# EasyEDA Pro project Project.eprj, schematic BachelorV5

## Sheets
1 Power: Board Name: BachelorV5; Create Date: 2026-01-30; Page Name: Power; Project Name: Bachelor; Schematic Name: BachelorV5; Update Date: 2026-04-13; Add into BOM: yes; Company: My Company; Convert to PCB: yes; Date: 2026-01-17; Draw By: IslandRock1; REV: 2.0; Sheet: 1/; spicePre: .
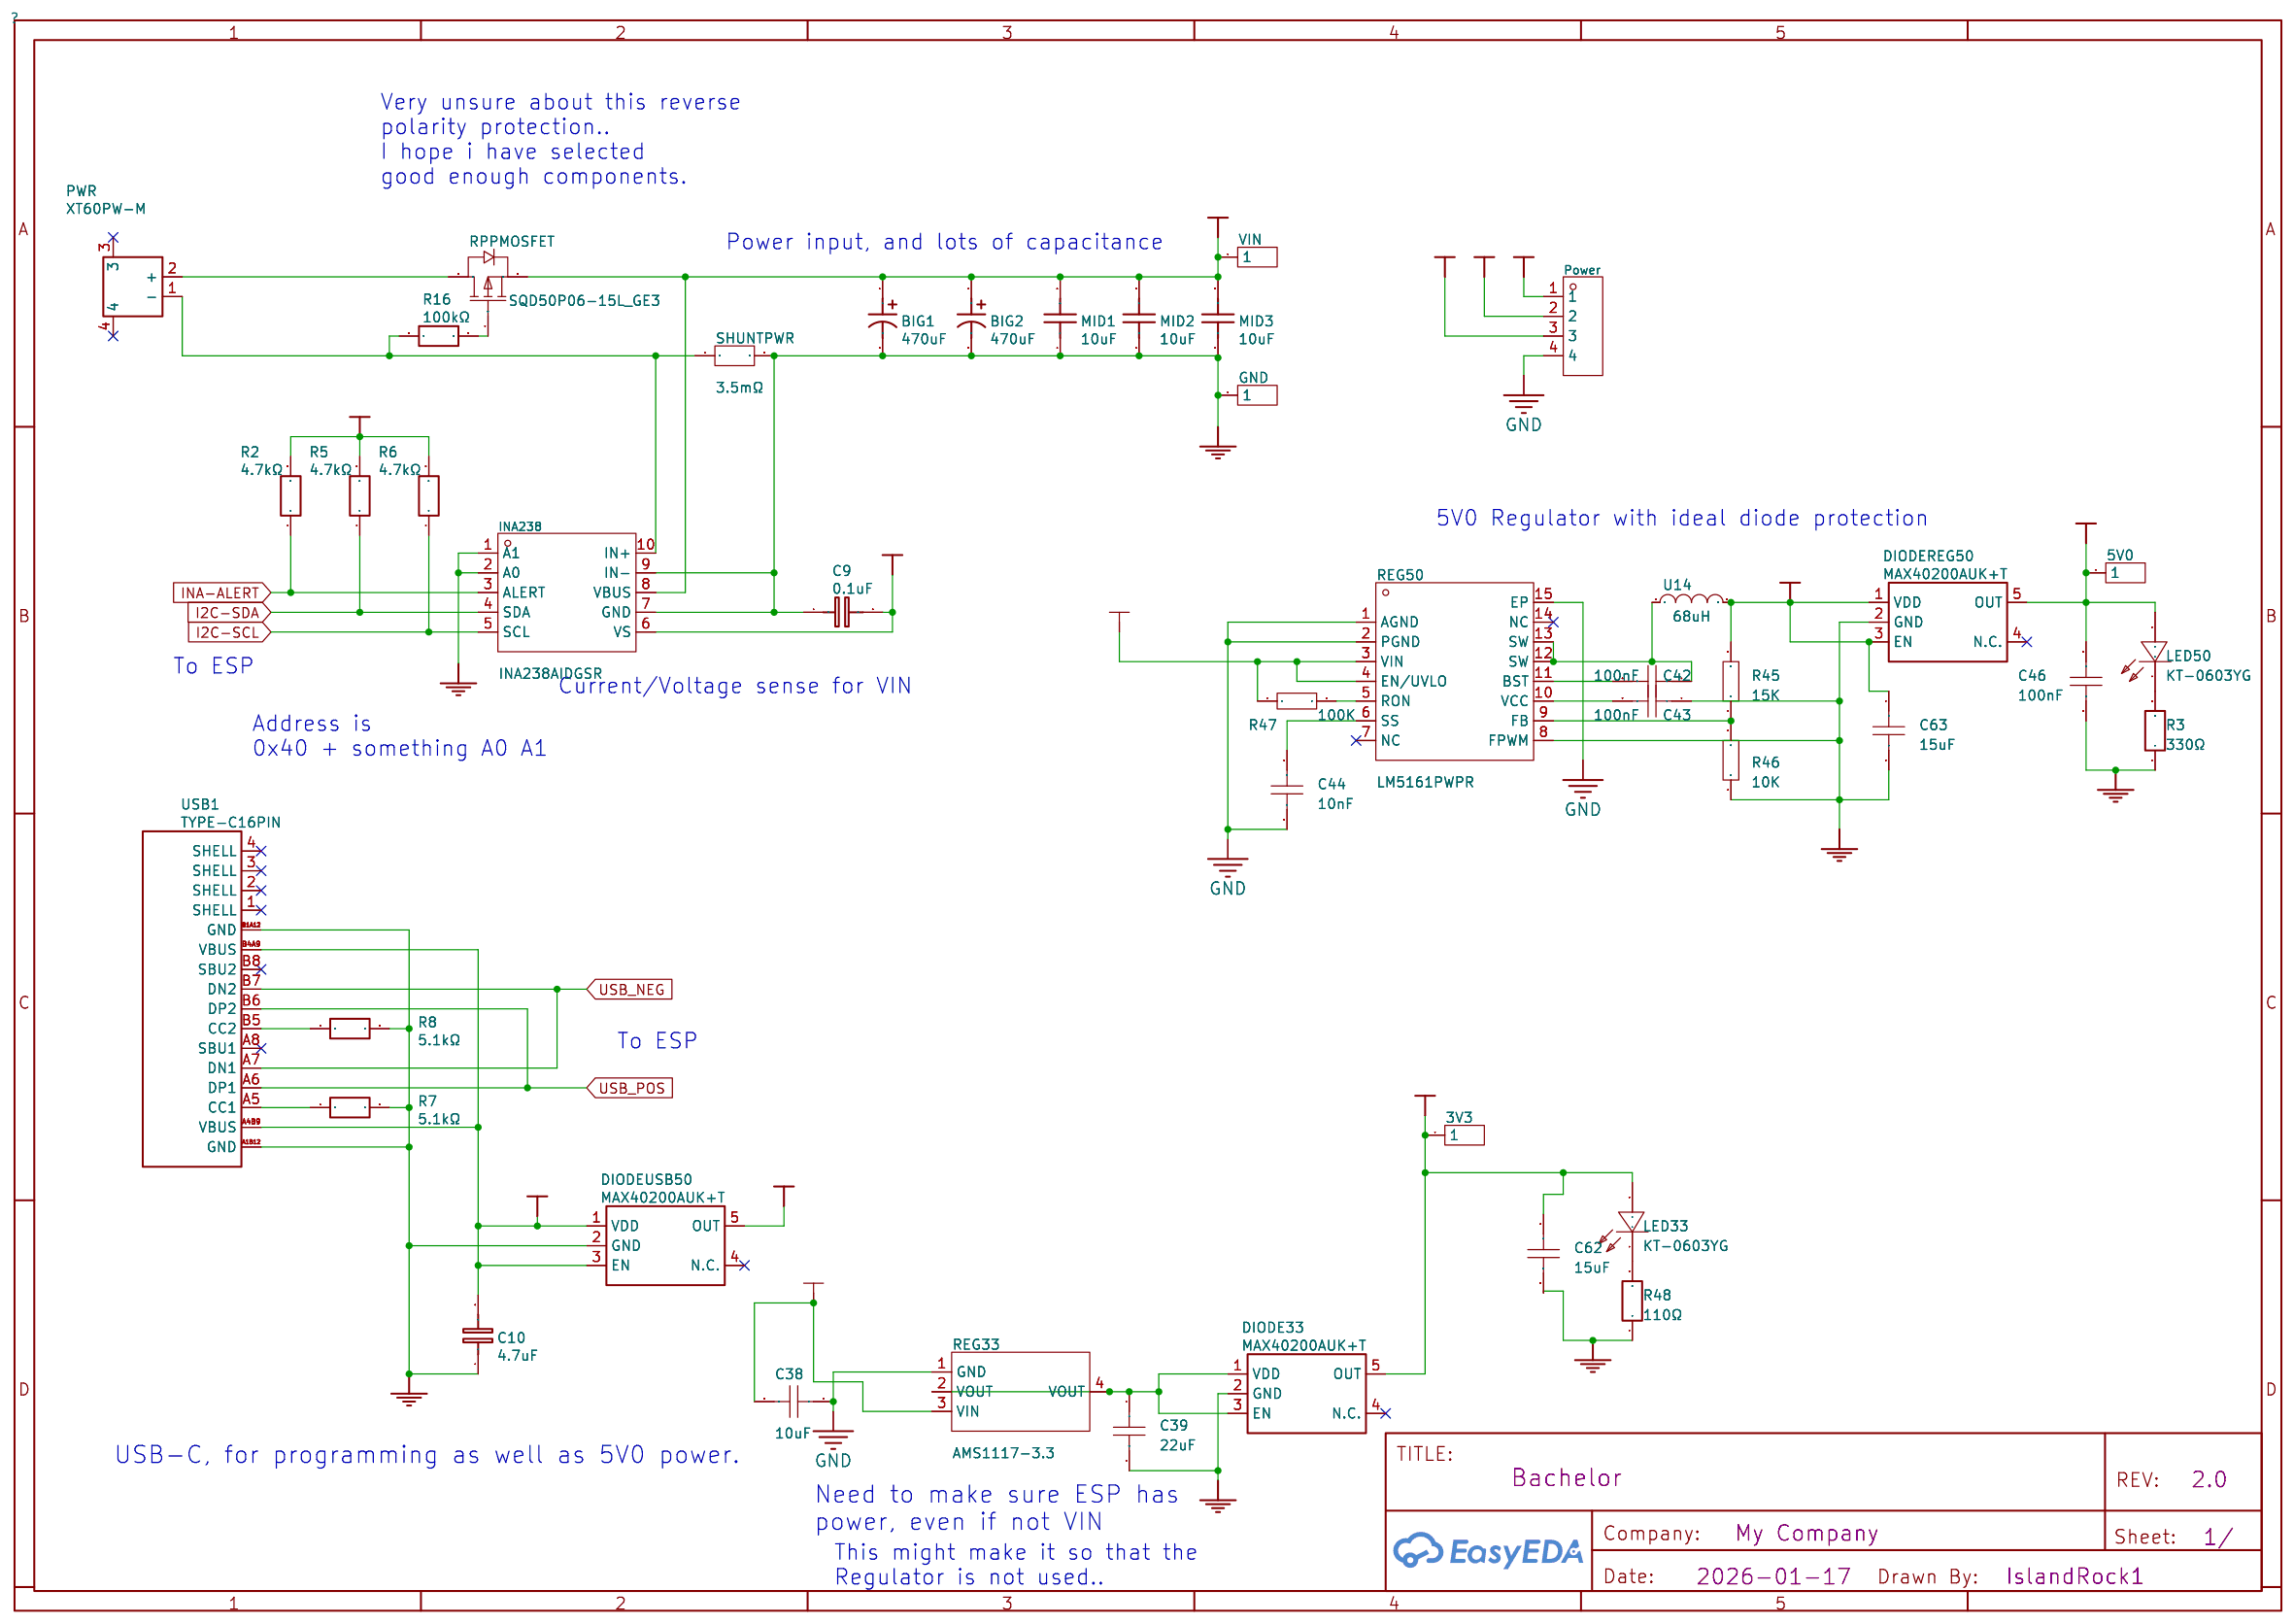
[diagram p0: Power]
2 Motor: Page Name: Motor; Update Date: 2026-04-19; Sheet: 2/
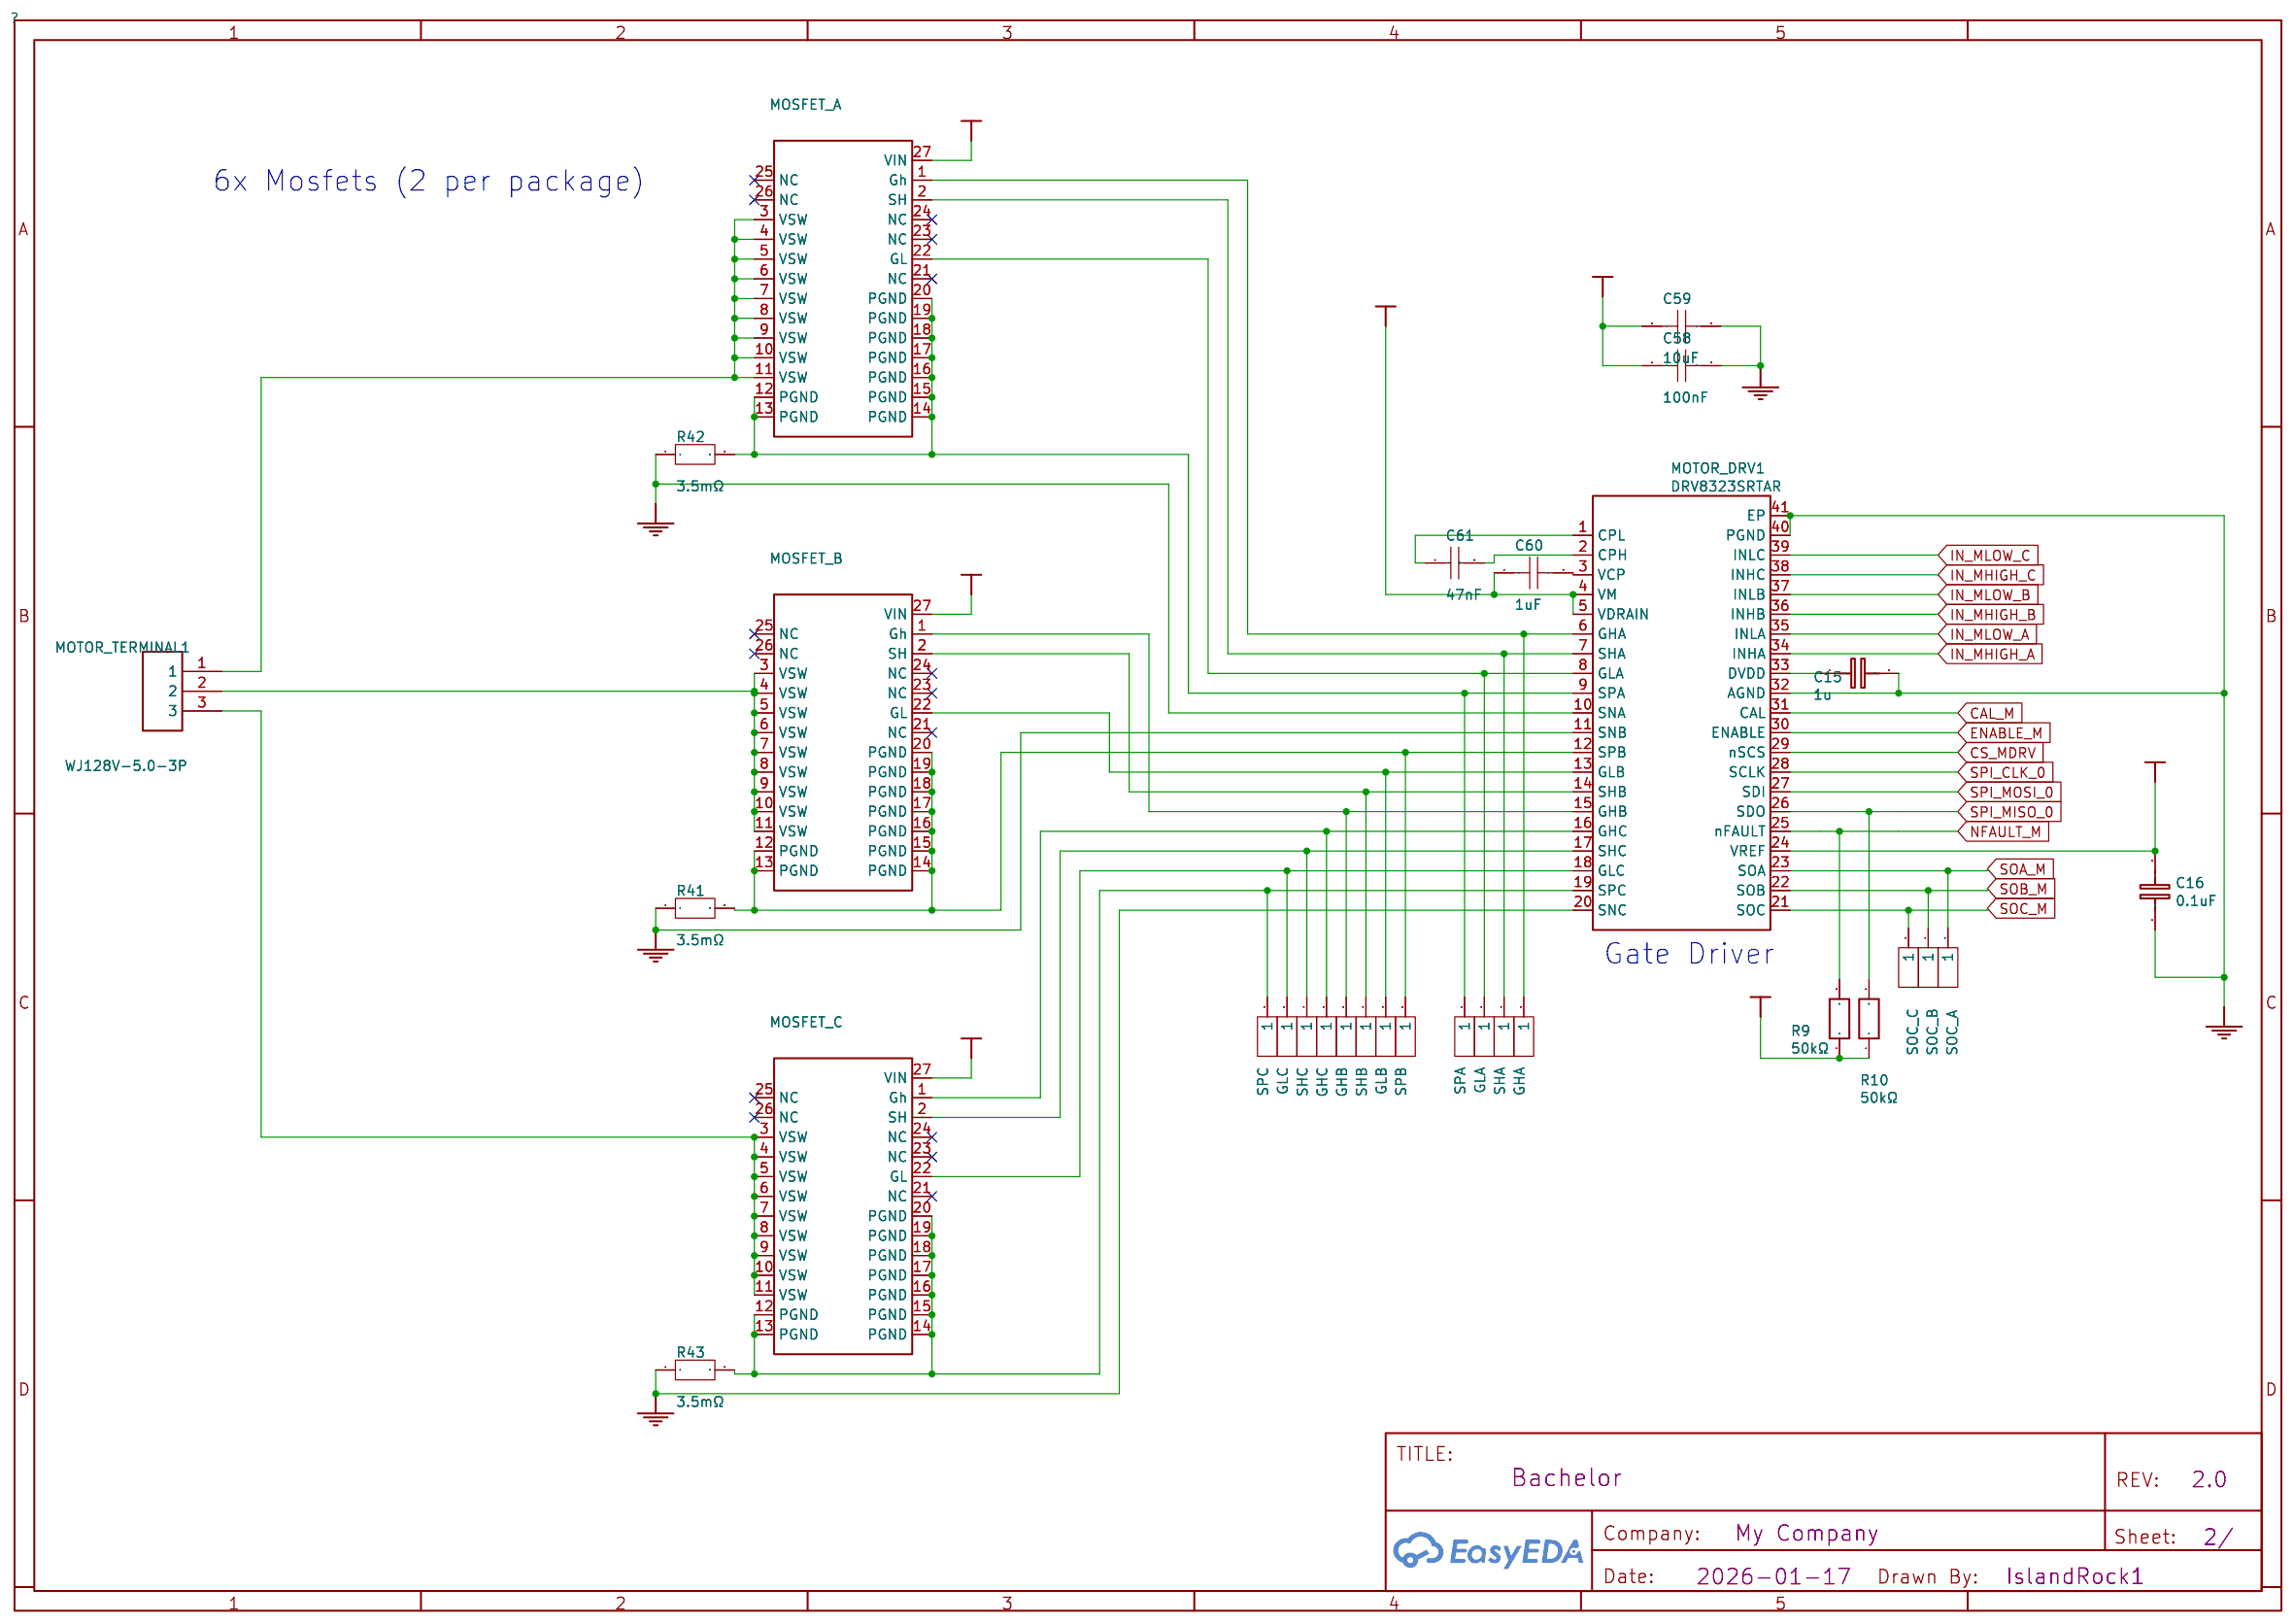
[diagram p1: Motor]
3 ESP32: Page Name: ESP32; Update Date: 2026-04-19; Sheet: 3/
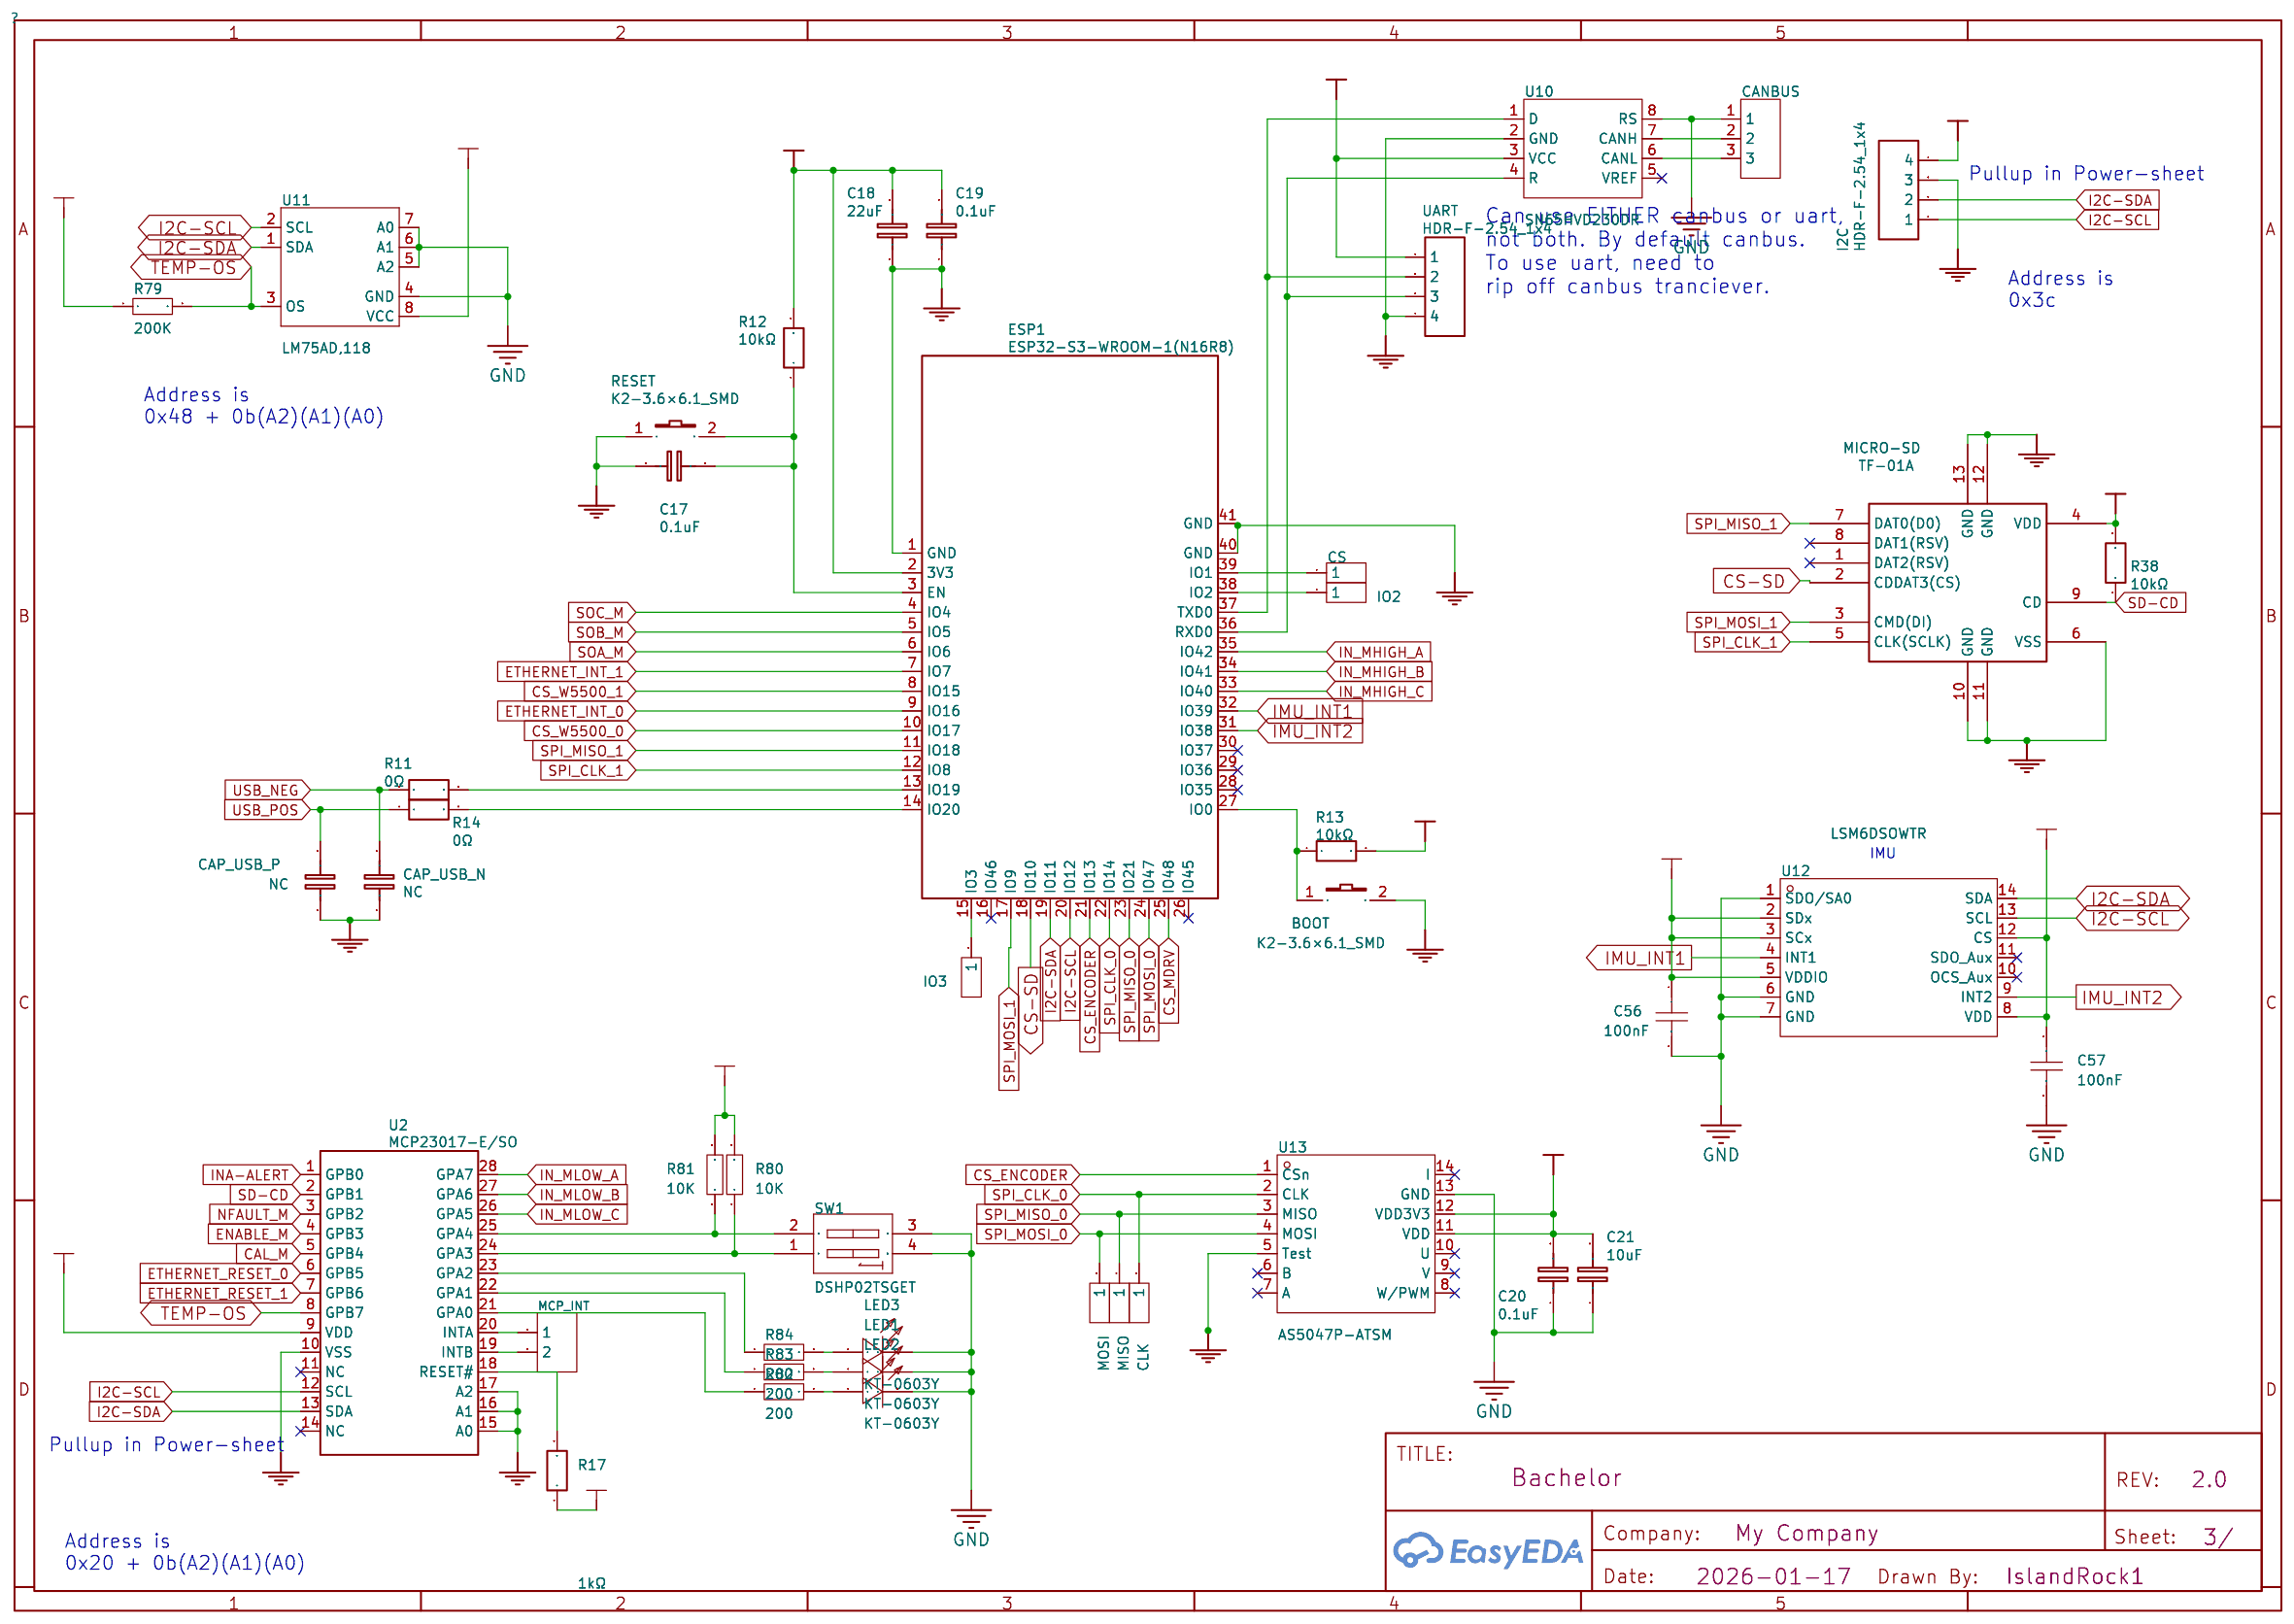
[diagram p2: ESP32]
4 Ethernet_0: Page Name: Ethernet_0; Date: 2026-01-22; REV: 1.0; Sheet: 1/1
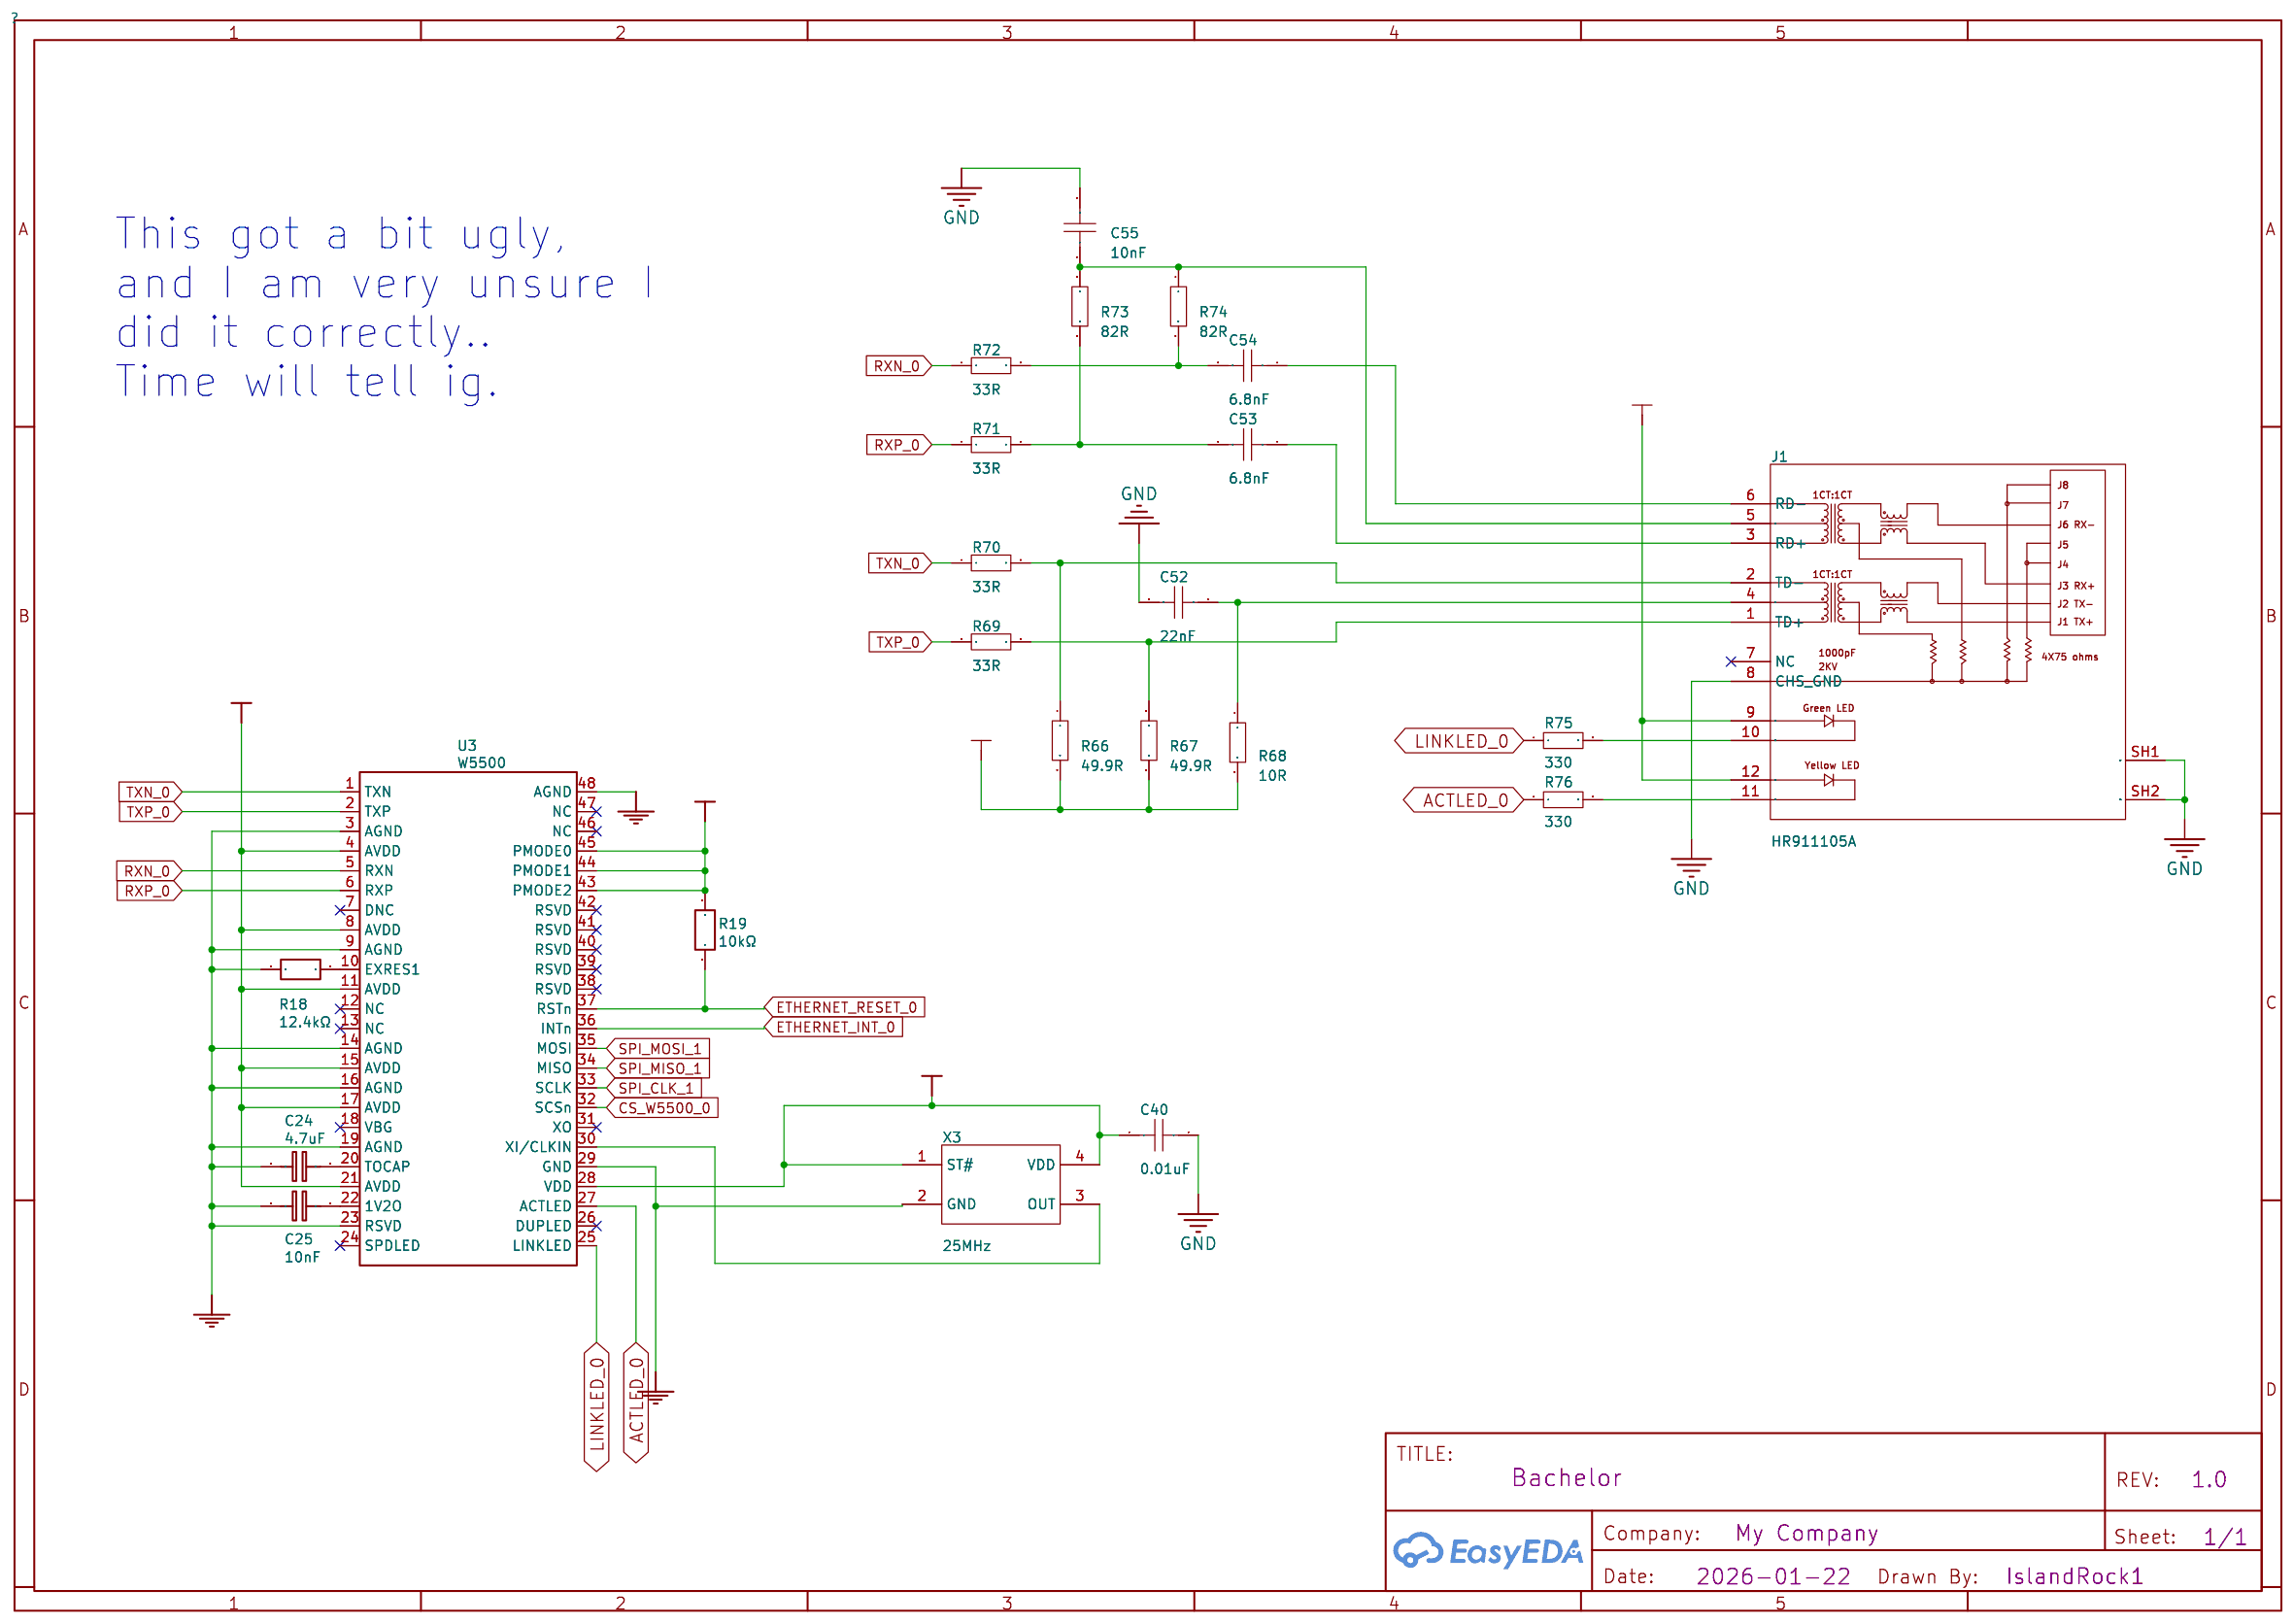
[diagram p3: Ethernet_0]
5 Ethernet_1: Page Name: Ethernet_1; Date: 2026-01-24; REV: 1.0; Sheet: 1/1
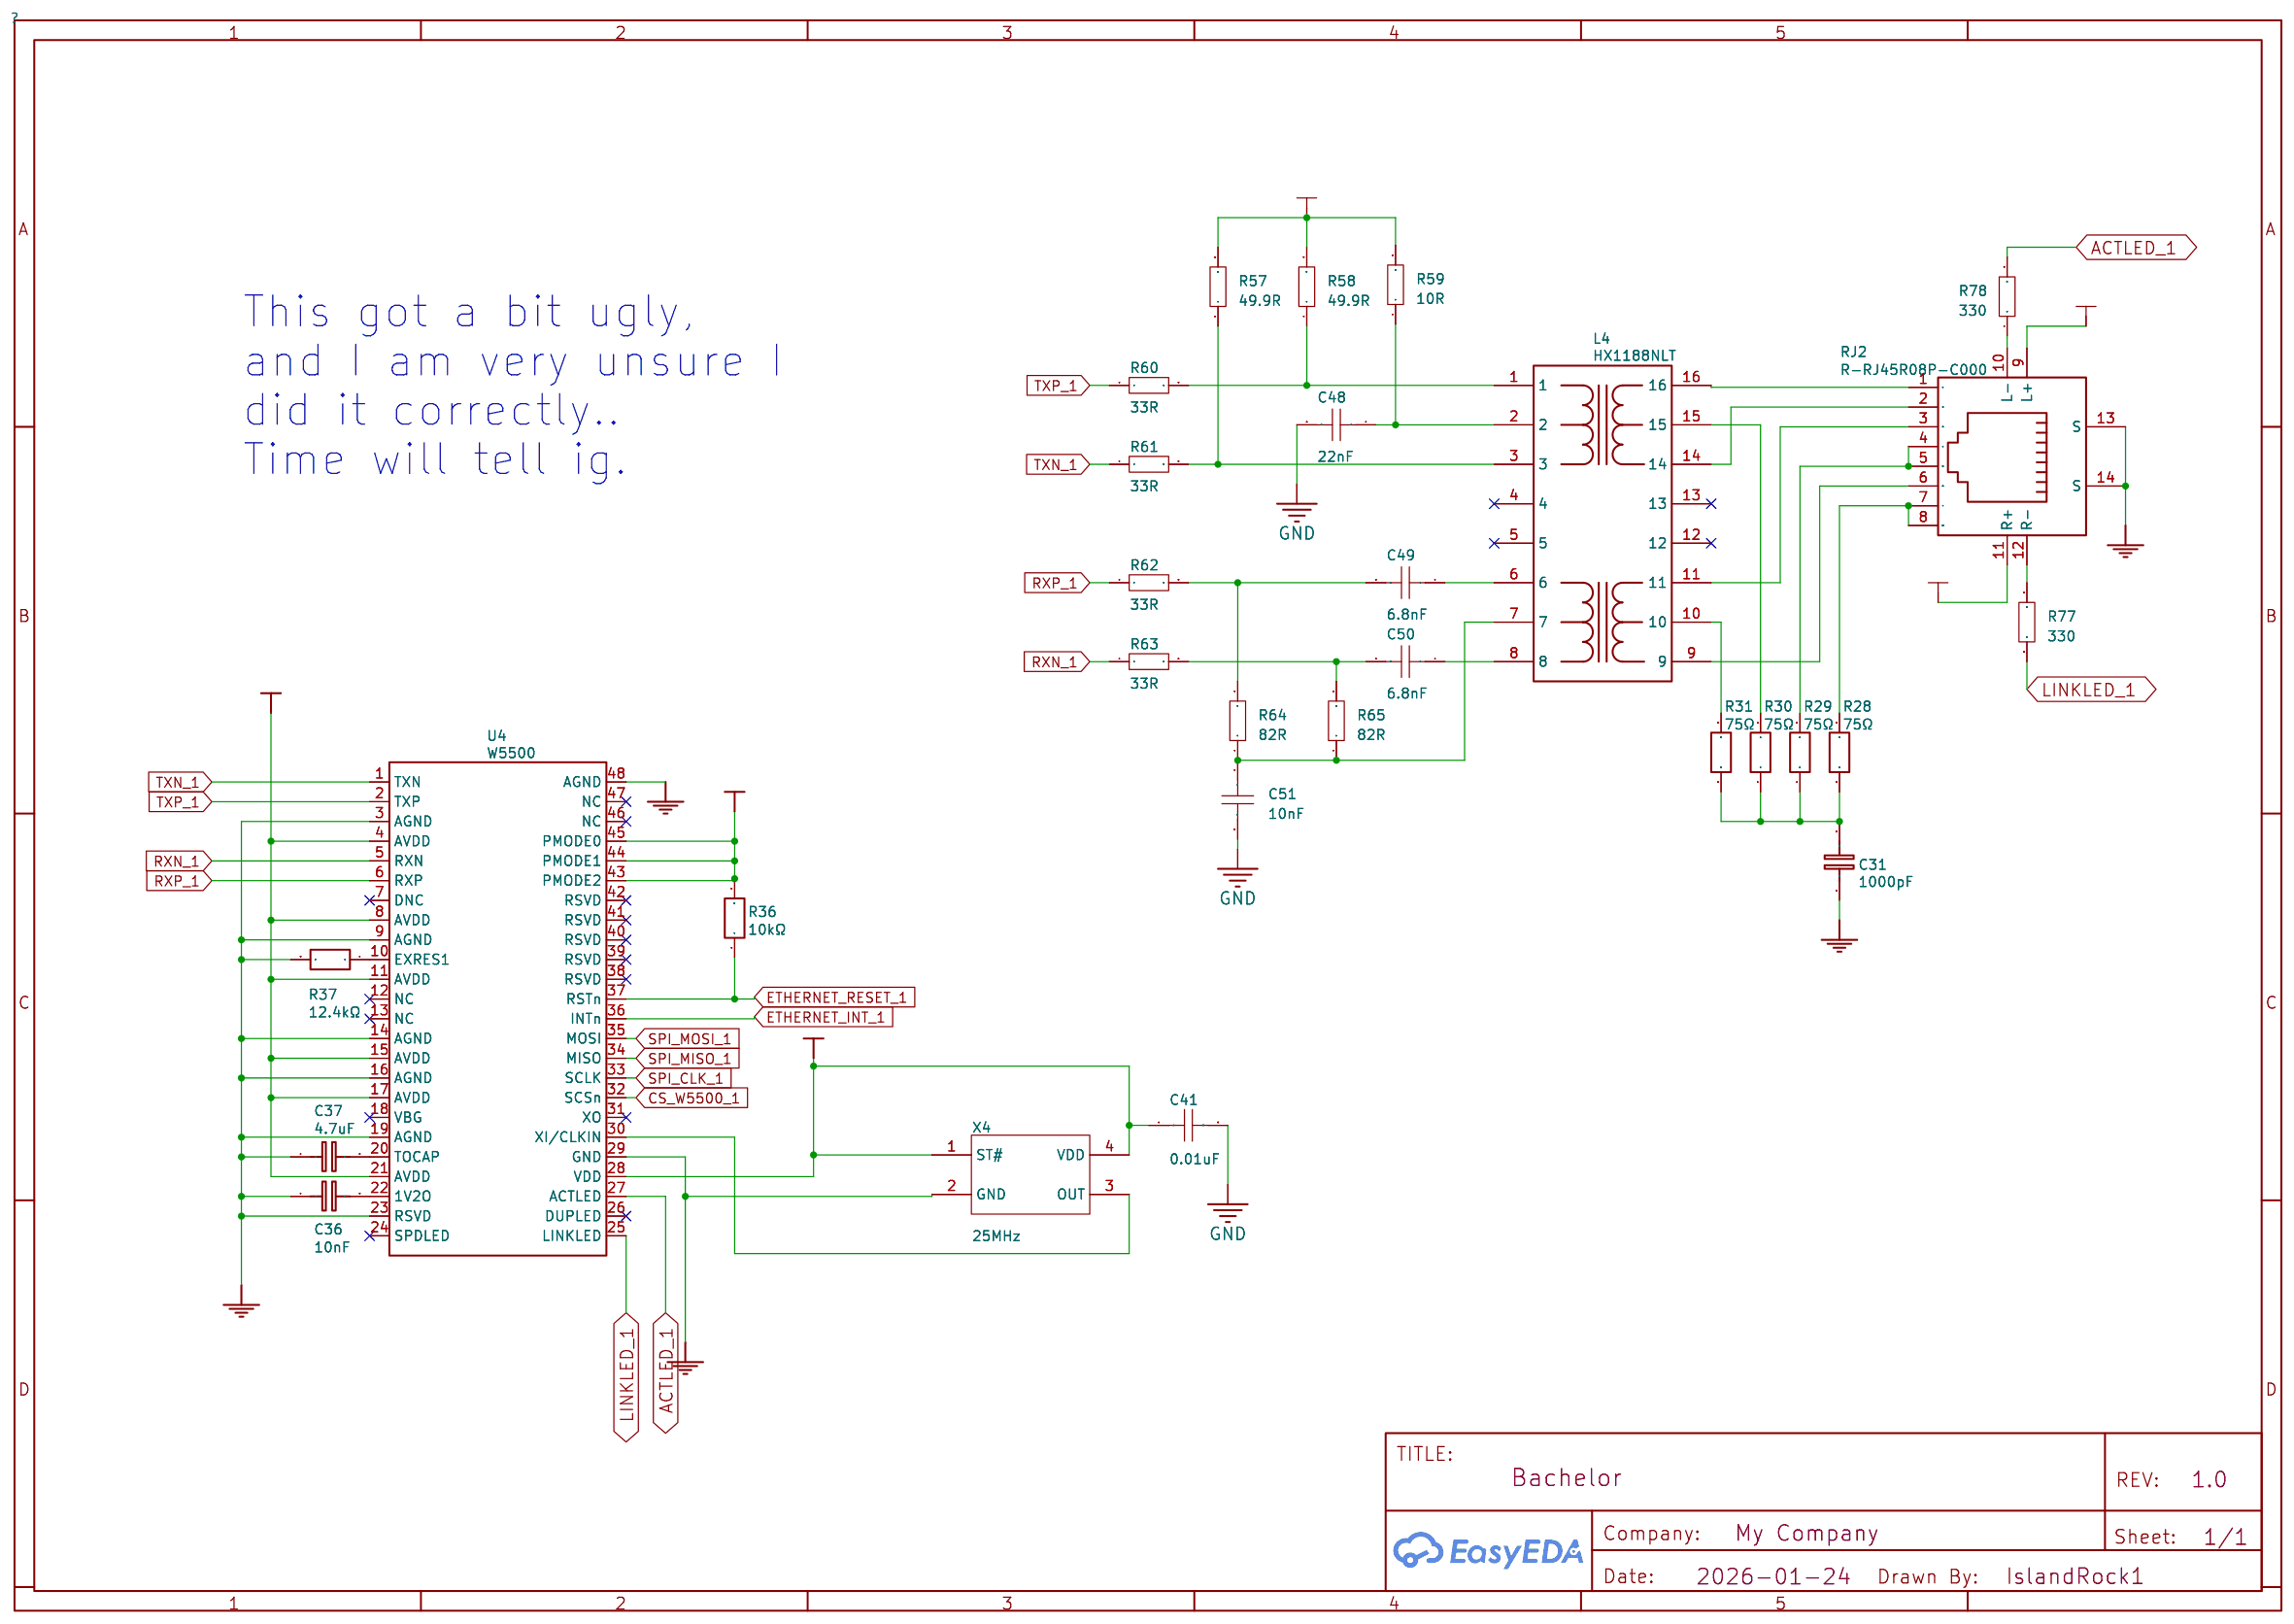
[diagram p4: Ethernet_1]

## Parts
sheet ESP32
BOOT  K2-3.6×6.1_SMD  [KEY-SMD_2P-L6.2-W3.6-LS8.0]
C17  0.1uF  [C0402]
C18  22uF  [C1206]
C19  0.1uF  [C0402]
C20  0.1uF  [C0402]
C21  10uF  [C0805]
C56  100nF  [C0201]
C57  100nF  [C0201]
CANBUS  -  [HDR-TH_3P-P2.54-V-F]
CAP_USB_N  NC  [C0201]
CAP_USB_P  NC  [C0201]
CLK  -  [HDR-TH_1P-V-M_XKB_X4611WV-01I-C28D40]
CS  -  [HDR-TH_1P-V-M_XKB_X4611WV-01I-C28D40]
ESP1  ESP32-S3-WROOM-1(N16R8)  [WIRELM-SMD_ESP32-S3-WROOM-1]
I2C  HDR-F-2.54_1x4  [HDR-F-2.54_1X4]
IO2  -  [HDR-TH_1P-V-M_XKB_X4611WV-01I-C28D40]
IO3  -  [HDR-TH_1P-V-M_XKB_X4611WV-01I-C28D40]
LED1  KT-0603Y  [LED0603-R-RD]
LED2  KT-0603Y  [LED0603-R-RD]
LED3  KT-0603Y  [LED0603-R-RD]
MCP_INT  -  [HDR-TH_2P-P2.54-V-F]
MICRO-SD  TF-01A  [TF-SMD_TF-01A]
MISO  -  [HDR-TH_1P-V-M_XKB_X4611WV-01I-C28D40]
MOSI  -  [HDR-TH_1P-V-M_XKB_X4611WV-01I-C28D40]
R11  0Ω  [R0201]
R12  10kΩ  [R0201]
R13  10kΩ  [R0201]
R14  0Ω  [R0201]
R17  1kΩ  [R0201]
R38  10kΩ  [R0201]
R79  200K  [R0201]
R80  10K  [R0201]
R81  10K  [R0201]
R82  200  [R0201]
R83  200  [R0201]
R84  200  [R0201]
RESET  K2-3.6×6.1_SMD  [KEY-SMD_2P-L6.2-W3.6-LS8.0]
SW1  DSHP02TSGET  [SW-SMD_4P_DSHP02TSGET]
U2  MCP23017-E/SO  [SOIC-28_L18.0-W7.5-P1.27-LS10.3-BL]
U10  SN65HVD230DR  [SOIC-8_L4.9-W3.9-P1.27-LS6.0-BL]
U11  LM75AD,118  [SOIC-8_L5.0-W4.0-P1.27-LS6.0-BL]
U12  LSM6DSOWTR  [LGA-14L_L3.0-W2.5-P0.50-TL]
U13  AS5047P-ATSM  [TSSOP-14_L5.0-W4.4-P0.65-LS6.4-BL]
UART  HDR-F-2.54_1x4  [HDR-F-2.54_1X4]
sheet Ethernet_0
C24  4.7uF  [C0805]
C25  10nF  [C0402]
C40  0.01uF  [C0402]
C52  22nF  [C0201]
C53  6.8nF  [C0201]
C54  6.8nF  [C0201]
C55  10nF  [C0201]
J1  HR911105A  [RJ45-TH_HR911105A]
R18  12.4kΩ  [R0201]
R19  10kΩ  [R0201]
R66  49.9R  [R0201]
R67  49.9R  [R0201]
R68  10R  [R0201]
R69  33R  [R0201]
R70  33R  [R0201]
R71  33R  [R0201]
R72  33R  [R0201]
R73  82R  [R0201]
R74  82R  [R0201]
R75  330  [R0201]
R76  330  [R0201]
U3  W5500  [LQFP-48_L7.0-W7.0-P0.50-LS9.0-BL]
X3  25MHz  [OSC-SMD_4P-L2.5-W2.0-BL]
sheet Ethernet_1
C31  1000pF  [C0402]
C36  10nF  [C0402]
C37  4.7uF  [C0805]
C41  0.01uF  [C0402]
C48  22nF  [C0201]
C49  6.8nF  [C0201]
C50  6.8nF  [C0201]
C51  10nF  [C0201]
L4  HX1188NLT  [RJ45-SMD_HX1188NLT]
R28  75Ω  [R0201]
R29  75Ω  [R0201]
R30  75Ω  [R0201]
R31  75Ω  [R0201]
R36  10kΩ  [R0201]
R37  12.4kΩ  [R0201]
R57  49.9R  [R0201]
R58  49.9R  [R0201]
R59  10R  [R0201]
R60  33R  [R0201]
R61  33R  [R0201]
R62  33R  [R0201]
R63  33R  [R0201]
R64  82R  [R0201]
R65  82R  [R0201]
R77  330  [R0201]
R78  330  [R0201]
RJ2  R-RJ45R08P-C000  [RJ45-TH_R-RJ45R08P-C000]
U4  W5500  [LQFP-48_L7.0-W7.0-P0.50-LS9.0-BL]
X4  25MHz  [OSC-SMD_4P-L2.5-W2.0-BL]
sheet Motor
C15  1u  [C0805]
C16  0.1uF  [C0402]
C58  100nF  [C0402]
C59  10uF  [C1210]
C60  1uF  [C0603]
C61  47nF  [C0603]
GHA  -  [HDR-TH_1P-V-M_XKB_X4611WV-01I-C28D40]
GHB  -  [HDR-TH_1P-V-M_XKB_X4611WV-01I-C28D40]
GHC  -  [HDR-TH_1P-V-M_XKB_X4611WV-01I-C28D40]
GLA  -  [HDR-TH_1P-V-M_XKB_X4611WV-01I-C28D40]
GLB  -  [HDR-TH_1P-V-M_XKB_X4611WV-01I-C28D40]
GLC  -  [HDR-TH_1P-V-M_XKB_X4611WV-01I-C28D40]
MOSFET_A  CSD88599Q5DC  [SON-22_L5.0-W6.0-P0.50-CSD88599Q5DCT]
MOSFET_B  CSD88599Q5DC  [SON-22_L5.0-W6.0-P0.50-CSD88599Q5DCT]
MOSFET_C  CSD88599Q5DC  [SON-22_L5.0-W6.0-P0.50-CSD88599Q5DCT]
MOTOR_DRV1  DRV8323SRTAR  [WQFN-40_L6.0-W6.0-P0.50-TL-EP4.5]
MOTOR_TERMINAL1  WJ128V-5.0-3P  [CONN-TH_3P-P5.00_WJ128V-5.0-3P]
R9  50kΩ  [R0402]
R10  50kΩ  [R0402]
R41  3.5mΩ  [RES-SMD_L6.4-W3.2-R2512]
R42  3.5mΩ  [RES-SMD_L6.4-W3.2-R2512]
R43  3.5mΩ  [RES-SMD_L6.4-W3.2-R2512]
SHA  -  [HDR-TH_1P-V-M_XKB_X4611WV-01I-C28D40]
SHB  -  [HDR-TH_1P-V-M_XKB_X4611WV-01I-C28D40]
SHC  -  [HDR-TH_1P-V-M_XKB_X4611WV-01I-C28D40]
SOC_A  -  [HDR-TH_1P-V-M_XKB_X4611WV-01I-C28D40]
SOC_B  -  [HDR-TH_1P-V-M_XKB_X4611WV-01I-C28D40]
SOC_C  -  [HDR-TH_1P-V-M_XKB_X4611WV-01I-C28D40]
SPA  -  [HDR-TH_1P-V-M_XKB_X4611WV-01I-C28D40]
SPB  -  [HDR-TH_1P-V-M_XKB_X4611WV-01I-C28D40]
SPC  -  [HDR-TH_1P-V-M_XKB_X4611WV-01I-C28D40]
sheet Power
3V3  -  [HDR-TH_1P-V-M_XKB_X4611WV-01I-C28D40]
5V0  -  [HDR-TH_1P-V-M_XKB_X4611WV-01I-C28D40]
BIG1  470uF  [CAP-TH_BD10.0-P5.00-D0.6-FD_2]
BIG2  470uF  [CAP-TH_BD10.0-P5.00-D0.6-FD_2]
C9  0.1uF  [C0402]
C10  4.7uF  [C0805]
C38  10uF  [C0805]
C39  22uF  [C1206]
C42  100nF  [C0201]
C43  100nF  [C0201]
C44  10nF  [C0201]
C46  100nF  [C0201]
C62  15uF  [C0402]
C63  15uF  [C0402]
DIODE33  MAX40200AUK+T  [TSOT-23-5_L2.9-W1.6-P0.95-LS2.8-BL]
DIODEREG50  MAX40200AUK+T  [TSOT-23-5_L2.9-W1.6-P0.95-LS2.8-BL]
DIODEUSB50  MAX40200AUK+T  [TSOT-23-5_L2.9-W1.6-P0.95-LS2.8-BL]
GND  -  [HDR-TH_1P-V-M_XKB_X4611WV-01I-C28D40]
INA238  INA238AIDGSR  [VSSOP-10_L3.0-W3.0-P0.50-LS4.9-BL]
LED33  KT-0603YG  [LED0603-RD]
LED50  KT-0603YG  [LED0603-RD]
MID1  10uF  [C1210]
MID2  10uF  [C1210]
MID3  10uF  [C1210]
Power  -  [HDR-TH_4P-P2.54-V-F]
PWR  XT60PW-M  [CONN-TH_XT60PW-M]
R2  4.7kΩ  [R0201]
R3  330Ω  [R0201]
R5  4.7kΩ  [R0201]
R6  4.7kΩ  [R0201]
R7  5.1kΩ  [R0201]
R8  5.1kΩ  [R0201]
R16  100kΩ  [R0201]
R45  15K  [R0201]
R46  10K  [R0201]
R47  100K  [R0201]
R48  110Ω  [R0201]
REG33  AMS1117-3.3  [SOT-223-3_L6.5-W3.4-P2.30-LS7.0-BR]
REG50  LM5161PWPR  [HTSSOP-14_L5.0-W4.4-P0.65-LS6.4-BL-EP3.0]
RPPMOSFET  SQD50P06-15L_GE3  [TO-252-2_L6.6-W6.1-P4.58-LS9.9-BR]
SHUNTPWR  3.5mΩ  [RES-SMD_L6.4-W3.2-R2512]
U14  68uH  [IND-SMD_L7.2-W6.6_GPSR07X0]
USB1  TYPE-C16PIN  [USB-C-SMD_TYPE-C16PIN]
VIN  -  [HDR-TH_1P-V-M_XKB_X4611WV-01I-C28D40]

## Library data of the parts
BOOT RESET = K2-3.6×6.1_SMD: Supplier Part: C118141; Supplier: LCSC; Manufacturer Part: K2-1107ST-A4SW-06; 制造商: 韩国韩荣; Contributor: LCEDA_Lib; spicePre: K
C9 C16 C17 C19 C20 = 0.1uF: nameAlias: Value(F); Contributor: LCEDA_Lib; spicePre: C; spiceSymbolName: C_0201_EU
C18 = 22uF: nameAlias: Value(F); Contributor: LCEDA_Lib; spicePre: C; spiceSymbolName: C_0201_EU
C21 = 10uF: nameAlias: Value(F); Contributor: LCEDA_Lib; spicePre: C; spiceSymbolName: C_0201_EU
C38-C44 C46 C48-C57 = CAP_0201: Supplier Footprint: 0201
CANBUS = HDR-F_2.54_1x3P: Supplier Footprint: Through
CAP_USB_N CAP_USB_P = NC: nameAlias: Value(F); Contributor: LCEDA_Lib; spicePre: C; spiceSymbolName: C_0201_EU
3V3 5V0 CLK CS GHA GHB GHC GLA GLB GLC GND IO2 IO3 MISO MOSI SHA SHB SHC SOC_A SOC_B SOC_C SPA SPB SPC VIN = HDR-M_2.54_1x1P: Supplier Footprint: Through
ESP1 = ESP32-S3-WROOM-1(N16R8): Supplier: LCSC; Supplier Part: C2913202; Manufacturer: ESPRESSIF(乐鑫); Manufacturer Part: ESP32-S3-WROOM-1-N16R8; JLCPCB Part Class: Extended Part; Contributor: lcsc; spicePre: U
I2C UART = HDR-F-2.54_1x4: Supplier Part: C225501; Supplier: LCSC; Contributor: LCEDA_Lib; spicePre: H
LED1-LED3 = KT-0603Y: LCSC Part Name: 0603 黄灯 高亮; Supplier Part: C2287; Manufacturer: KENTO; Supplier Footprint: 0603; JLCPCB Part Class: Extended Part; Datasheet: https://item.szlcsc.com/datasheet/KT-0603Y/2660.html; Supplier: LCSC; Illumination Color: Yellow; Voltage - Forward(Vf): 2.4V; Power(Watts): 40mW; Wavelength - Dominant: 584nm~594nm; Peak Wavelength: 596nm; Lens Color: Water Clear; Luminous Intensity: 175mcd; Viewing Angle: 120°; Operating Temperature: -40℃~+85℃
MCP_INT = HDR-F_2.54_1x2P: Supplier Footprint: Through
MICRO-SD = TF-01A: Supplier: LCSC; Manufacturer: 韩国韩荣; Supplier Part: C91145; JLCPCB Part Class: Extended Part; spicePre: C
R11 R14 = 0Ω: nameAlias: Value(Ω); Contributor: LCEDA_Lib; spicePre: R; spiceSymbolName: R_0201_EU
R12 R13 R19 R36 R38 = 10kΩ: nameAlias: Value(Ω); Contributor: LCEDA_Lib; spicePre: R; spiceSymbolName: R_0201_EU
R17 = 1kΩ: nameAlias: Value(Ω); Contributor: LCEDA_Lib; spicePre: R; spiceSymbolName: R_0201_EU
R45-R47 R57-R84 = Res_0201: Supplier Footprint: 0201
SW1 = DSHP02TSGET: LCSC Part Name: 2位 1.27间距; Supplier Part: C40735; Manufacturer: YE; Supplier Footprint: SMD-4P,5.4x4.1mm; JLCPCB Part Class: Extended Part; Datasheet: https://item.szlcsc.com/datasheet/DSHP02TSGET/41719.html; Supplier: LCSC; Type: Slide, Recessed; Circuit: SPST; Number of Positions: 2; Lead Pitch: 1.27mm; Color: Black
U2 = MCP23017-E/SO: Supplier: LCSC; Manufacturer: MICROCHIP(美国微芯); Supplier Part: C47023; JLCPCB Part Class: Extended Part; link: https://lcsc.com/eda_search?q=C47023&%26type=1&ref=editor; Contributor: LCSC; spicePre: U
U10 = SN65HVD230DR: LCSC Part Name: 3.3-V CAN 收发器; Supplier Part: C12084; Manufacturer: TI(德州仪器); Supplier Footprint: SOIC-8; JLCPCB Part Class: Extended Part; Datasheet: https://www.ti.com/cn/lit/gpn/sn65hvd230; Supplier: LCSC; Type: CANtransceiver; Data Rate: 1Mbps; Operating Temperature: -40℃~+85℃
U11 = LM75AD,118: LCSC Part Name: 数字温度传感器和热监控器; Supplier Part: C7963; Manufacturer: NXP(恩智浦); Supplier Footprint: SOIC-8; JLCPCB Part Class: Extended Part; Datasheet: https://www.nxp.com.cn/docs/en/data-sheet/LM75A.pdf; Supplier: LCSC; Detection Temperature Range: -55℃~+125℃; Tolerance: ±2℃; Voltage - Supply: 2.8V~5.5V; Interface: I2C; Temperature Conversion Time: 100ms; Temperature Resolution: 11bit
U12 = LSM6DSOWTR: LCSC Part Name: 三维加速度计和三维陀螺仪; Supplier Part: C2829074; Manufacturer: ST(意法半导体); Supplier Footprint: LGA-14(2.5x3); JLCPCB Part Class: Extended Part; Datasheet: https://item.szlcsc.com/datasheet/LSM6DSOWTR/2978501.html; Supplier: LCSC; Accelerometer Sensing Axis: X,Y,Z; Acceleration Measurement Range (MAX): ±16g; Gyroscope Sensing Axis: X,Y,Z; Gyroscope Measurement Range (MAX): ±2000dps; Sensor Type: IMU; Interface: I3C；I2C；SPI; Voltage - Supply: 1.71V~5.6V; Cache Size: 9KB; Standby Current: 3uA; Operating Temperature: -40℃~+85℃
U13 = AS5047P-ATSM_C962063: Supplier Part: C962063; Manufacturer: ams(艾迈斯半导体); Supplier Footprint: TSSOP-14; JLCPCB Part Class: Extended Part; Datasheet: https://item.szlcsc.com/datasheet/AS5047P-ATSM/1043057.html; Supplier: LCSC
C10 C24 C37 = 4.7uF: nameAlias: Value(F); Contributor: LCEDA_Lib; spicePre: C; spiceSymbolName: C_0201_EU
C25 C36 = 10nF: nameAlias: Value(F); Contributor: LCEDA_Lib; spicePre: C; spiceSymbolName: C_0201_EU
J1 = HR911105A_C12074: LCSC Part Name: 弯插 带LED; Supplier Part: C12074; Manufacturer: HANRUN(汉仁); Supplier Footprint: 插件; JLCPCB Part Class: Extended Part; Datasheet: https://item.szlcsc.com/datasheet/HR911105A/12651.html; Supplier: LCSC; Connector Type: RJ45 Jack; Mounting Type: Right Angle; Number of Ports: 1; LED: With LED; Shielding: Shielded; PoE: Non-PoE; Supplementary Features: Filtered; Contact Material: Phosphor Bronze; Contact Plating: Gold; Operating Temperature: 0℃~+70℃
R18 R37 = 12.4kΩ: nameAlias: Value(Ω); Contributor: LCEDA_Lib; spicePre: R; spiceSymbolName: R_0201_EU
U3 U4 = W5500: Supplier Part: C32843; Supplier: LCSC; Manufacturer: WIZNET; JLCPCB Part Class: Extended Part; spicePre: U
X3 X4 = X1G0041710033: LCSC Part Name: X1G004171003300; Supplier Part: C70560; Manufacturer: EPSON(爱普生); Supplier Footprint: SMD2520-4P; JLCPCB Part Class: Extended Part; Datasheet: https://item.szlcsc.com/datasheet/X1G0041710033/71658.html; Supplier: LCSC; Normal temperature Frequency Tolerance: ±50ppm; Output Type: CMOS; Voltage - Supply: 1.62V~3.63V; Current - Supply: 2.2mA; Operating Temperature: -40℃~+85℃
C31 = 1500pF: nameAlias: Value(F); Contributor: LCEDA_Lib; spicePre: C; spiceSymbolName: C_0201_EU
L4 = HX1188NLT: Supplier: LCSC; Manufacturer: PULSE(普思); Supplier Part: C9363; JLCPCB Part Class: Extended Part; spicePre: L
R28-R31 = 75Ω: nameAlias: Value(Ω); Contributor: LCEDA_Lib; spicePre: R; spiceSymbolName: R_0201_EU
RJ2 = R-RJ45R08P-C000: Supplier: LCSC; Supplier Part: C386757; Manufacturer: Ckmtw(灿科盟); JLCPCB Part Class: Extended Part; Contributor: LCSC; spicePre: R
C15 = 1u: nameAlias: Value(F); Contributor: LCEDA_Lib; spicePre: C; spiceSymbolName: C_0201_EU
C58 = GRM155R62A104KE14D: LCSC Part Name: NRND物料(将要停产) 原厂不接订单 100nF ±10% 100V; Supplier Part: C162178; Manufacturer: muRata(村田); Supplier Footprint: 0402; Datasheet: https://item.szlcsc.com/datasheet/GRM155R62A104KE14D/173559.html; Supplier: LCSC; Tolerance: ±10%; Voltage Rating: 100V; Temperature Coefficient: X5R
C59 = GRM32EC72A106KE05L: LCSC Part Name: 10uF ±10% 100V; Supplier Part: C576517; Manufacturer: muRata(村田); Supplier Footprint: 1210; JLCPCB Part Class: Extended Part; Datasheet: https://item.szlcsc.com/datasheet/GRM32EC72A106KE05L/604008.html; Supplier: LCSC; Tolerance: ±10%; Voltage Rating: 100V; Temperature Coefficient: X7S
C60 = GRM188D72A105KE01D: LCSC Part Name: 1uF ±10% 100V; Supplier Part: C23829972; Manufacturer: muRata(村田); Supplier Footprint: 0603; Datasheet: https://item.szlcsc.com/datasheet/GRM188D72A105KE01D/25559750.html; Supplier: LCSC; Tolerance: ±10%; Voltage Rating: 100V; Temperature Coefficient: X7T
C61 = 0603B473K101NT: LCSC Part Name: 47nF ±10% 100V; Supplier Part: C43254; Manufacturer: FH(风华); Supplier Footprint: 0603; Datasheet: https://item.szlcsc.com/datasheet/0603B473K101NT/44245.html; Supplier: LCSC; Tolerance: ±10%; Voltage Rating: 100V; Temperature Coefficient: X7R
MOSFET_A MOSFET_B MOSFET_C = CSD88599Q5DC: LCSC Part Name: 60V半桥NexFET电源块; Supplier Part: C2871380; Manufacturer: TI(德州仪器); Supplier Footprint: VSON-22(5x6); JLCPCB Part Class: Extended Part; Datasheet: https://www.ti.com/cn/lit/gpn/csd88599q5dc; Supplier: LCSC; Drain to Source Voltage: 60V; RDS(on): 2.1mΩ@10V; Pd - Power Dissipation: 12W; Gate Threshold Voltage (Vgs(th)): 2V; Gate Charge(Qg): 56nC@10V; Input Capacitance(Ciss): 4.84nF; Reverse Transfer Capacitance (Crss@Vds): 16pF; Configuration: Half-Bridge; Output Capacitance(Coss): 870pF
MOTOR_DRV1 = DRV8323SRTAR: Supplier: LCSC; Supplier Part: C701784; Manufacturer: TI(德州仪器); JLCPCB Part Class: Extended Part; Contributor: LCSC; spicePre: U
MOTOR_TERMINAL1 = WJ128V-5.0-3P: Supplier: LCSC; Manufacturer: KANGNEX(康奈克斯电气); Manufacturer Part: WJ128V-5.0-03P-14-00A; Supplier Part: C8270; JLCPCB Part Class: Extended Part; spicePre: P
R9 R10 = 50kΩ: nameAlias: Value(Ω); Contributor: LCEDA_Lib; spicePre: R; spiceSymbolName: R_0201_EU
R41-R43 SHUNTPWR = LRBN25GFER0035S: LCSC Part Name: 3.5mΩ ±1% 3W; Supplier Part: C5121063; Manufacturer: NCT(利昇达); Supplier Footprint: 2512; JLCPCB Part Class: Extended Part; Datasheet: https://item.szlcsc.com/datasheet/LRBN25GFER0035S/5707129.html; Supplier: LCSC; Type: Current Sense Resistor; Tolerance: ±1%; Power(Watts): 3W
BIG1 BIG2 = 470uF: Supplier: LCSC; Supplier Part: C44606499; Manufacturer: SHENGYANG(升阳); Manufacturer Part: SH477M063G1700; JLCPCB Part Class: Extended Part; nameAlias: Value; Contributor: lcsc; spicePre: C; spiceSymbolName: SH477M063G1700
C62 C63 = CAP_0402: Supplier Part: C1525; Supplier Footprint: 0402
DIODE33 DIODEREG50 DIODEUSB50 = MAX40200AUK+T: Supplier: LCSC; Supplier Part: C2649430; Manufacturer: ADI(亚德诺)/MAXIM(美信); JLCPCB Part Class: Extended Part; Contributor: LCSC; spicePre: U
INA238 = INA238AIDGSR: LCSC Part Name: 高精度功率监控器，具有I²C接口; Supplier Part: C2868250; Manufacturer: TI(德州仪器); Supplier Footprint: VSSOP-10-0.5mm; JLCPCB Part Class: Extended Part; Datasheet: https://www.ti.com/cn/lit/gpn/ina238; Supplier: LCSC; Vcm - Common Mode Voltage: -300mV~85V; Ib - Input Bias Current: 2.5nA; Vos - Input Offset Voltage: 1.5uV; Operating Temperature: -40℃~+125℃; Differential Voltage: ±163.84mV; Single Supply: 2.7V~5.5V; Quiescent Current: 640uA; Output Current: 10mA; Input Offset Voltage Drift(Vos TC): 0.02uV/℃; Common Mode Rejection Ratio (CMRR): 160dB
LED33 LED50 = KT-0603YG: LCSC Part Name: 0603 黄绿 普绿; Supplier Part: C2289; Manufacturer: KENTO; Supplier Footprint: 0603; JLCPCB Part Class: Extended Part; Datasheet: https://item.szlcsc.com/datasheet/KT-0603YG/2662.html; Supplier: LCSC; Illumination Color: Yellow Green; Voltage - Forward(Vf): 2V~2.2V; Power(Watts): 40mW; Forward Current: 20mA; Wavelength - Dominant: 567nm~573nm; Diode Configuration: Discrete Diode; Lens Color: Water Clear; Luminous Intensity: 30mcd~42mcd; Viewing Angle: 120°; Mounting Style: op View Mount; Operating Temperature: -40℃~+85℃
MID1-MID3 = 10uF: Supplier: LCSC; Supplier Part: C5159419; Manufacturer: TDK; Manufacturer Part: CGA6P1X7R1N106KT0Y0E; JLCPCB Part Class: Extended Part; Contributor: lcsc; nameAlias: Value; spicePre: C; spiceSymbolName: CGA6P1X7R1N106KT0Y0E
Power = HDR-F_2.54_1x4P: Supplier Footprint: Through
PWR = XT60PW-M: Supplier: LCSC; Supplier Part: C98732; Manufacturer: AMASS(艾迈斯); JLCPCB Part Class: Extended Part; Contributor: LCSC; spicePre: C
R2 R5 R6 = 4k7Ω: nameAlias: Value(Ω); Contributor: LCEDA_Lib; spicePre: R; spiceSymbolName: R_0201_EU
R3 R48 = >=340Ω: nameAlias: Value(Ω); Contributor: LCEDA_Lib; spicePre: R; spiceSymbolName: R_0201_EU
R7 R8 = 5k1Ω: nameAlias: Value(Ω); Contributor: LCEDA_Lib; spicePre: R; spiceSymbolName: R_0201_EU
R16 = 100kΩ: nameAlias: Value(Ω); Contributor: LCEDA_Lib; spicePre: R; spiceSymbolName: R_0201_EU
REG33 = AMS1117-3.3_C6186: LCSC Part Name: 输出3.3V 1A; Supplier Part: C6186; Manufacturer: AMS; Supplier Footprint: SOT-223; JLCPCB Part Class: Basic Part; Datasheet: https://item.szlcsc.com/datasheet/AMS1117-3.3/6652.html; Supplier: LCSC; Output Type: Fixed; Voltage - Supply: 16V; Output Voltage: 3.3V; Output Current: 1A; Power Supply Rejection Ratio (PSRR): 72dB@(120Hz); Voltage Dropout: 1.1V@(800mA); standby current: 5mA; Noise: 0.003%Vout; Features: Over Current Protection；Over Temperature Protection; Operating Temperature: -40℃~+125℃; Output Configuration: Positive; Number of Outputs: 1
REG50 = LM5161PWPR: LCSC Part Name: 100V 1A 同步降压转换器; Supplier Part: C468246; Manufacturer: TI(德州仪器); Supplier Footprint: HTSSOP-14-EP; JLCPCB Part Class: Extended Part; Datasheet: https://www.ti.com/cn/lit/gpn/lm5161; Supplier: LCSC; Function: Step-down type; Output Type: Adjustable; Input Voltage: 4.5V~100V; Output Voltage: 2V~92V; Output Current: 1A; Switching Frequency: 1MHz; Operating Temperature: -40℃~+125℃@(TJ); Synchronous Rectification: Yes; Number of Outputs: 1; Topology: Step-down；Flyback; Switch tube (built-in/external): Built-in
RPPMOSFET = SQD50P06-15L_GE3: LCSC Part Name: 1个P沟道 耐压:60V 电流:50A; Supplier Part: C3281500; Manufacturer: VISHAY(威世); Supplier Footprint: TO-252; JLCPCB Part Class: Extended Part; Datasheet: https://item.szlcsc.com/datasheet/SQD50P06-15L_GE3/3844398.html; Supplier: LCSC; Number: 1 P-Channel; Drain to Source Voltage: 60V; Current - Continuous Drain(Id): 50A; RDS(on): 15.5mΩ@10V; Pd - Power Dissipation: 136W; Gate Threshold Voltage (Vgs(th)): 2.5V@250uA; Gate Charge(Qg): 98nC@10V; Input Capacitance(Ciss): 5.91nF; Reverse Transfer Capacitance (Crss@Vds): 410pF; Operating Temperature: -55℃~+175℃; Type: P-Channel; Output Capacitance(Coss): 606pF
U14 = CYA0650-68UH: LCSC Part Name: 68uH ±20%; Supplier Part: C5189964; Manufacturer: SHOU HAN(首韩); Supplier Footprint: SMD,7.2x6.6mm; Datasheet: https://atta.szlcsc.com/upload/public/pdf/source/20221010/1CB48C1FE5E3157A229723F3ED8F3EBC.pdf; Supplier: LCSC; Tolerance: ±20%
USB1 = TYPE-C16PIN: Supplier: LCSC; Supplier Part: C393939; Manufacturer: SHOU HAN(首韩); JLCPCB Part Class: Extended Part; Contributor: LCSC; spicePre: U

## Nets
3V3: 3V3.1 C9.2 C16.2 C18.2 C19.2 C20.2 C21.2 C40.1 C41.1 C56.1 C57.1 C62.1 DIODE33.5(OUT) ESP1.2(3V3) I2C.4 INA238.6(VS) J1.9 J1.12 LED33.2(A) MICRO-SD.4(VDD) MOTOR_DRV1.24(VREF) Power.3 R2.2 R5.2 R6.2 R9.1 R10.1 R12.2 R13.2 R17.1 R19.2 R36.2 R38.2 R57.2 R58.2 R59.2 R66.2 R67.2 R68.2 R79.1 R80.2 R81.2 RJ2.9(L+) RJ2.11(R+) U2.9(VDD) U3.4(AVDD) U3.8(AVDD) U3.11(AVDD) U3.15(AVDD) U3.17(AVDD) U3.21(AVDD) U3.28(VDD) U3.43(PMODE2) U3.44(PMODE1) U3.45(PMODE0) U4.4(AVDD) U4.8(AVDD) U4.11(AVDD) U4.15(AVDD) U4.17(AVDD) U4.21(AVDD) U4.28(VDD) U4.43(PMODE2) U4.44(PMODE1) U4.45(PMODE0) U10.3(VCC) U11.8(VCC) U12.2(SDx) U12.3(SCx) U12.5(VDDIO) U12.8(VDD) U12.12(CS) U13.11(VDD) U13.12(VDD3V3) UART.1 X3.1(ST#) X3.4(VDD) X4.1(ST#) X4.4(VDD)
5V0: 5V0.1 C38.2 C46.1 DIODEREG50.5(OUT) DIODEUSB50.5(OUT) LED50.2(A) Power.2 REG33.3(VIN)
5V0-RAW: C63.1 DIODEREG50.1(VDD) DIODEREG50.3(EN) R45.2 U14.2
5V0_USB: C10.2 DIODEUSB50.1(VDD) DIODEUSB50.3(EN) USB1.A4B9(VBUS) USB1.B4A9(VBUS)
GND: BIG1.2 BIG2.2 BOOT.2 C9.1 C10.1 C15.2 C16.1 C17.1 C18.1 C19.1 C20.1 C21.1 C24.1 C25.1 C31.1 C36.1 C37.1 C38.1 C39.2 C40.2 C41.2 C43.1 C44.2 C46.2 C48.2 C51.2 C52.2 C55.2 C56.2 C57.2 C58.2 C59.2 C62.2 C63.2 CANBUS.1 CAP_USB_N.1 CAP_USB_P.1 DIODE33.2(GND) DIODEREG50.2(GND) DIODEUSB50.2(GND) ESP1.1(GND) ESP1.40(GND) ESP1.41(GND) GND.1 I2C.3 INA238.1(A1) INA238.2(A0) INA238.7(GND) INA238.9(IN-) J1.8(CHS GND) J1.SH1 J1.SH2 LED1.2(K) LED2.2(K) LED3.2(K) MICRO-SD.6(VSS) MICRO-SD.10(GND) MICRO-SD.11(GND) MICRO-SD.12(GND) MICRO-SD.13(GND) MID1.1 MID2.1 MID3.1 MOTOR_DRV1.10(SNA) MOTOR_DRV1.11(SNB) MOTOR_DRV1.20(SNC) MOTOR_DRV1.32(AGND) MOTOR_DRV1.40(PGND) MOTOR_DRV1.41(EP) Power.4 R3.1 R7.2 R8.2 R18.2 R37.2 R41.1 R42.1 R43.1 R46.1 R48.1 REG33.1(GND) REG50.1(AGND) REG50.2(PGND) REG50.8(FPWM) REG50.15(EP) RESET.1 RJ2.13(S) RJ2.14(S) SHUNTPWR.2 SW1.3(B2) SW1.4(B1) U2.10(VSS) U2.15(A0) U2.16(A1) U2.17(A2) U3.3(AGND) U3.9(AGND) U3.14(AGND) U3.16(AGND) U3.19(AGND) U3.23(RSVD) U3.29(GND) U3.48(AGND) U4.3(AGND) U4.9(AGND) U4.14(AGND) U4.16(AGND) U4.19(AGND) U4.23(RSVD) U4.29(GND) U4.48(AGND) U10.2(GND) U10.8(RS) U11.4(GND) U11.5(A2) U11.6(A1) U11.7(A0) U12.1(SDO/SA0) U12.6(GND) U12.7(GND) U13.5(Test) U13.13(GND) UART.4 USB1.A1B12(GND) USB1.B1A12(GND) X3.2(GND) X4.2(GND)
VIN: BIG1.1 BIG2.1 C58.1 C59.1 C60.1 INA238.8(VBUS) MID1.2 MID2.2 MID3.2 MOSFET_A.27(VIN) MOSFET_B.27(VIN) MOSFET_C.27(VIN) MOTOR_DRV1.4(VM) MOTOR_DRV1.5(VDRAIN) Power.1 R47.1 REG50.3(VIN) REG50.4(EN/UVLO) RPPMOSFET.3(S) VIN.1
ACTLED_0: R76.1 U3.27(ACTLED)
ACTLED_1: R78.2 U4.27(ACTLED)
CAL_M: MOTOR_DRV1.31(CAL) U2.5(GPB4)
CS-SD: ESP1.18(IO10) MICRO-SD.2(CDDAT3(CS))
CS_ENCODER: ESP1.21(IO13) U13.1(CSn)
CS_MDRV: ESP1.25(IO48) MOTOR_DRV1.29(nSCS)
CS_W5500_0: ESP1.10(IO17) U3.32(SCSn)
CS_W5500_1: ESP1.8(IO15) U4.32(SCSn)
ENABLE_M: MOTOR_DRV1.30(ENABLE) U2.4(GPB3)
ETHERNET_INT_0: ESP1.9(IO16) U3.36(INTn)
ETHERNET_INT_1: ESP1.7(IO7) U4.36(INTn)
ETHERNET_RESET_0: R19.1 U2.6(GPB5) U3.37(RSTn)
ETHERNET_RESET_1: R36.1 U2.7(GPB6) U4.37(RSTn)
I2C-SCL: ESP1.20(IO12) I2C.1 INA238.5(SCL) R6.1 U2.12(SCL) U11.2(SCL) U12.13(SCL)
I2C-SDA: ESP1.19(IO11) I2C.2 INA238.4(SDA) R5.1 U2.13(SDA) U11.1(SDA) U12.14(SDA)
IMU_INT1: ESP1.32(IO39) U12.4(INT1)
IMU_INT2: ESP1.31(IO38) U12.9(INT2)
IN_MHIGH_A: ESP1.35(IO42) MOTOR_DRV1.34(INHA)
IN_MHIGH_B: ESP1.34(IO41) MOTOR_DRV1.36(INHB)
IN_MHIGH_C: ESP1.33(IO40) MOTOR_DRV1.38(INHC)
IN_MLOW_A: MOTOR_DRV1.35(INLA) U2.28(GPA7)
IN_MLOW_B: MOTOR_DRV1.37(INLB) U2.27(GPA6)
IN_MLOW_C: MOTOR_DRV1.39(INLC) U2.26(GPA5)
INA-ALERT: INA238.3(ALERT) R2.1 U2.1(GPB0)
LINKLED_0: R75.1 U3.25(LINKLED)
LINKLED_1: R77.1 U4.25(LINKLED)
NFAULT_M: MOTOR_DRV1.25(nFAULT) R9.2 U2.3(GPB2)
RXN_0: R72.1 U3.5(RXN)
RXN_1: R63.1 U4.5(RXN)
RXP_0: R71.1 U3.6(RXP)
RXP_1: R62.1 U4.6(RXP)
SD-CD: MICRO-SD.9(CD) R38.1 U2.2(GPB1)
SOA_M: ESP1.6(IO6) MOTOR_DRV1.23(SOA) SOC_A.1
SOB_M: ESP1.5(IO5) MOTOR_DRV1.22(SOB) SOC_B.1
SOC_M: ESP1.4(IO4) MOTOR_DRV1.21(SOC) SOC_C.1
SPI_CLK_0: CLK.1 ESP1.22(IO14) MOTOR_DRV1.28(SCLK) U13.2(CLK)
SPI_CLK_1: ESP1.12(IO8) MICRO-SD.5(CLK(SCLK)) U3.33(SCLK) U4.33(SCLK)
SPI_MISO_0: ESP1.23(IO21) MISO.1 MOTOR_DRV1.26(SDO) R10.2 U13.3(MISO)
SPI_MISO_1: ESP1.11(IO18) MICRO-SD.7(DAT0(D0)) U3.34(MISO) U4.34(MISO)
SPI_MOSI_0: ESP1.24(IO47) MOSI.1 MOTOR_DRV1.27(SDI) U13.4(MOSI)
SPI_MOSI_1: ESP1.17(IO9) MICRO-SD.3(CMD(DI)) U3.35(MOSI) U4.35(MOSI)
TEMP-OS: R79.2 U2.8(GPB7) U11.3(OS)
TXN_0: R70.1 U3.1(TXN)
TXN_1: R61.1 U4.1(TXN)
TXP_0: R69.1 U3.2(TXP)
TXP_1: R60.1 U4.2(TXP)
USB_NEG: CAP_USB_N.2 R11.1 USB1.A7(DN1) USB1.B7(DN2)
USB_POS: CAP_USB_P.2 R14.1 USB1.A6(DP1) USB1.B6(DP2)
$1N21: INA238.10(IN+) PWR.1(-) R16.2 SHUNTPWR.1
$1N28: R8.1 USB1.B5(CC2)
$1N29: R7.1 USB1.A5(CC1)
$1N46: C39.1 DIODE33.1(VDD) DIODE33.3(EN) REG33.2(VOUT) REG33.4(VOUT)
$1N52: PWR.2(+) RPPMOSFET.2(D)
$1N53: R16.1 RPPMOSFET.1(G)
$1N3919: LED50.1(K) R3.2
$1N8597: C42.2 REG50.11(BST)
$1N8601: C42.1 REG50.12(SW) REG50.13(SW) U14.1
$1N8664: C43.2 REG50.10(VCC)
$1N8745: R45.1 R46.2 REG50.9(FB)
$1N8854: R47.2 REG50.5(RON)
$1N8916: C44.1 REG50.6(SS)
$1N9309: LED33.1(K) R48.2
$2N19: C15.1 MOTOR_DRV1.33(DVDD)
$2N21: C61.2 MOTOR_DRV1.2(CPH)
$2N22: C61.1 MOTOR_DRV1.1(CPL)
$2N36: MOSFET_B.3(VSW) MOSFET_B.4(VSW) MOSFET_B.5(VSW) MOSFET_B.6(VSW) MOSFET_B.7(VSW) MOSFET_B.8(VSW) MOSFET_B.9(VSW) MOSFET_B.10(VSW) MOSFET_B.11(VSW) MOTOR_TERMINAL1.2
$2N4941: MOSFET_A.3(VSW) MOSFET_A.4(VSW) MOSFET_A.5(VSW) MOSFET_A.6(VSW) MOSFET_A.7(VSW) MOSFET_A.8(VSW) MOSFET_A.9(VSW) MOSFET_A.10(VSW) MOSFET_A.11(VSW) MOTOR_TERMINAL1.1
$2N4957: MOSFET_C.3(VSW) MOSFET_C.4(VSW) MOSFET_C.5(VSW) MOSFET_C.6(VSW) MOSFET_C.7(VSW) MOSFET_C.8(VSW) MOSFET_C.9(VSW) MOSFET_C.10(VSW) MOSFET_C.11(VSW) MOTOR_TERMINAL1.3
$2N6377: C60.2 MOTOR_DRV1.3(VCP)
$3N13: ESP1.14(IO20) R14.2
$3N14: ESP1.13(IO19) R11.2
$3N15: C17.2 ESP1.3(EN) R12.1 RESET.2
$3N36: BOOT.1 ESP1.27(IO0) R13.1
$3N47: R17.2 U2.18(RESET#)
$3N65: ESP1.37(TXD0) U10.1(D) UART.2
$3N66: ESP1.36(RXD0) U10.4(R) UART.3
$3N7389: CANBUS.2 U10.7(CANH)
$3N7393: CANBUS.3 U10.6(CANL)
$3N12439: LED2.1(A) R82.2
$3N12443: LED1.1(A) R83.2
$3N12605: LED3.1(A) R84.2
$3N12968: MCP_INT.1 U2.20(INTA)
$3N12972: MCP_INT.2 U2.19(INTB)
$3N18193: R80.1 SW1.1(A1) U2.24(GPA3)
$3N18363: R81.1 SW1.2(A2) U2.25(GPA4)
$3N18414: R84.1 U2.23(GPA2)
$3N18419: R83.1 U2.22(GPA1)
$3N18426: R82.1 U2.21(GPA0)
$4N550: R18.1 U3.10(EXRES1)
$4N551: C24.2 U3.20(TOCAP)
$4N552: C25.2 U3.22(1V2O)
$4N1114: U3.30(XI/CLKIN) X3.3(OUT)
$4N3318: C53.2 R71.2 R73.2
$4N3326: C54.2 R72.2 R74.2
$4N4184: J1.10 R75.2
$4N4188: J1.11 R76.2
$4N4282: C53.1 J1.3(RD+)
$4N4289: C55.1 J1.5 R73.1 R74.1
$4N4295: C52.1 J1.4 R68.1
$4N4303: J1.2(TD-) R66.1 R70.2
$4N4311: J1.1(TD+) R67.1 R69.2
$4N4371: C54.1 J1.6(RD-)
$5N6: L4.16 RJ2.1
$5N7: L4.14 RJ2.2
$5N8: L4.11 RJ2.3
$5N9: R29.2 RJ2.4 RJ2.5
$5N10: L4.9 RJ2.6
$5N11: R28.2 RJ2.7 RJ2.8
$5N12: C31.2 R28.1 R29.1 R30.1 R31.1
$5N15: L4.15 R30.2
$5N17: L4.10 R31.2
$5N556: C36.2 U4.22(1V2O)
$5N557: C37.2 U4.20(TOCAP)
$5N558: R37.1 U4.10(EXRES1)
$5N1145: U4.30(XI/CLKIN) X4.3(OUT)
$5N3079: L4.1 R58.1 R60.2
$5N3084: L4.3 R57.1 R61.2
$5N3090: C48.1 L4.2 R59.1
$5N3391: C49.1 L4.6
$5N3426: C50.1 L4.8
$5N3458: C49.2 R62.2 R64.2
$5N3491: C50.2 R63.2 R65.2
$5N3572: C51.1 L4.7 R64.1 R65.1
$5N4851: R77.2 RJ2.12(R-)
$5N4855: R78.1 RJ2.10(L-)
Net-(CS-1): CS.1 ESP1.39(IO1)
Net-(ESP1-15): ESP1.15(IO3) IO3.1
Net-(ESP1-38): ESP1.38(IO2) IO2.1
Net-(GHA-1): GHA.1 MOSFET_A.1(Gh) MOTOR_DRV1.6(GHA)
Net-(GHB-1): GHB.1 MOSFET_B.1(Gh) MOTOR_DRV1.15(GHB)
Net-(GHC-1): GHC.1 MOSFET_C.1(Gh) MOTOR_DRV1.16(GHC)
Net-(GLA-1): GLA.1 MOSFET_A.22(GL) MOTOR_DRV1.8(GLA)
Net-(GLB-1): GLB.1 MOSFET_B.22(GL) MOTOR_DRV1.13(GLB)
Net-(GLC-1): GLC.1 MOSFET_C.22(GL) MOTOR_DRV1.18(GLC)
Net-(MOSFET_A-2): MOSFET_A.2(SH) MOTOR_DRV1.7(SHA) SHA.1
Net-(MOSFET_A-12): MOSFET_A.12(PGND) MOSFET_A.13(PGND) MOSFET_A.14(PGND) MOSFET_A.15(PGND) MOSFET_A.16(PGND) MOSFET_A.17(PGND) MOSFET_A.18(PGND) MOSFET_A.19(PGND) MOSFET_A.20(PGND) MOTOR_DRV1.9(SPA) R42.2 SPA.1
Net-(MOSFET_B-2): MOSFET_B.2(SH) MOTOR_DRV1.14(SHB) SHB.1
Net-(MOSFET_B-12): MOSFET_B.12(PGND) MOSFET_B.13(PGND) MOSFET_B.14(PGND) MOSFET_B.15(PGND) MOSFET_B.16(PGND) MOSFET_B.17(PGND) MOSFET_B.18(PGND) MOSFET_B.19(PGND) MOSFET_B.20(PGND) MOTOR_DRV1.12(SPB) R41.2 SPB.1
Net-(MOSFET_C-2): MOSFET_C.2(SH) MOTOR_DRV1.17(SHC) SHC.1
Net-(MOSFET_C-12): MOSFET_C.12(PGND) MOSFET_C.13(PGND) MOSFET_C.14(PGND) MOSFET_C.15(PGND) MOSFET_C.16(PGND) MOSFET_C.17(PGND) MOSFET_C.18(PGND) MOSFET_C.19(PGND) MOSFET_C.20(PGND) MOTOR_DRV1.19(SPC) R43.2 SPC.1

Not connected (* = marked no-connect by the designer): DIODE33 4(N.C.)*; DIODEREG50 4(N.C.)*; DIODEUSB50 4(N.C.)*; ESP1 16(IO46)* 26(IO45)* 28(IO35)* 29(IO36)* 30(IO37)*; J1 7(NC)*; L4 4* 5* 12* 13*; MICRO-SD 1(DAT2(RSV))* 8(DAT1(RSV))*; MOSFET_A 21(NC)* 23(NC)* 24(NC)* 25(NC)* 26(NC)*; MOSFET_B 21(NC)* 23(NC)* 24(NC)* 25(NC)* 26(NC)*; MOSFET_C 21(NC)* 23(NC)* 24(NC)* 25(NC)* 26(NC)*; PWR 3* 4*; REG50 7(NC)* 14(NC)*; U2 11(NC)* 14(NC)*; U3 7(DNC)* 12(NC)* 13(NC)* 18(VBG)* 24(SPDLED)* 26(DUPLED)* 31(XO)* 38(RSVD)* 39(RSVD)* 40(RSVD)* 41(RSVD)* 42(RSVD)* 46(NC)* 47(NC)*; U4 7(DNC)* 12(NC)* 13(NC)* 18(VBG)* 24(SPDLED)* 26(DUPLED)* 31(XO)* 38(RSVD)* 39(RSVD)* 40(RSVD)* 41(RSVD)* 42(RSVD)* 46(NC)* 47(NC)*; U10 5(VREF)*; U12 10(OCS_Aux)* 11(SDO_Aux)*; U13 6(B)* 7(A)* 8(W/PWM)* 9(V)* 10(U)* 14(I)*; USB1 1(SHELL)* 2(SHELL)* 3(SHELL)* 4(SHELL)* A8(SBU1)* B8(SBU2)*

## Notes on the sheets
sheet 1
- Very unsure about this reverse
  polarity protection..
  I hope i have selected
  good enough components.
- Power input, and lots of capacitance
- 5V0 Regulator with ideal diode protection
- To ESP
- Current/Voltage sense for VIN
- Address is
  0x40 + something A0 A1
- To ESP
- USB-C, for programming as well as 5V0 power.
- Need to make sure ESP has
  power, even if not VIN
- This might make it so that the
  Regulator is not used..
sheet 2
- 6x Mosfets (2 per package)
- Gate Driver
sheet 3
- Pullup in Power-sheet
- Address is
  0x3c
- Can use EITHER canbus or uart,
  not both. By default canbus.
  To use uart, need to
  rip off canbus tranciever.
- Address is
  0x48 + 0b(A2)(A1)(A0)
- IMU
- Pullup in Power-sheet
- Address is
  0x20 + 0b(A2)(A1)(A0)
sheet 4
- This got a bit ugly,
  and I am very unsure I
  did it correctly..
  Time will tell ig.
sheet 5
- This got a bit ugly,
  and I am very unsure I
  did it correctly..
  Time will tell ig.
